# EasyEDA Pro project adapter_rfm95w_nrf242.eprj, board PCB5
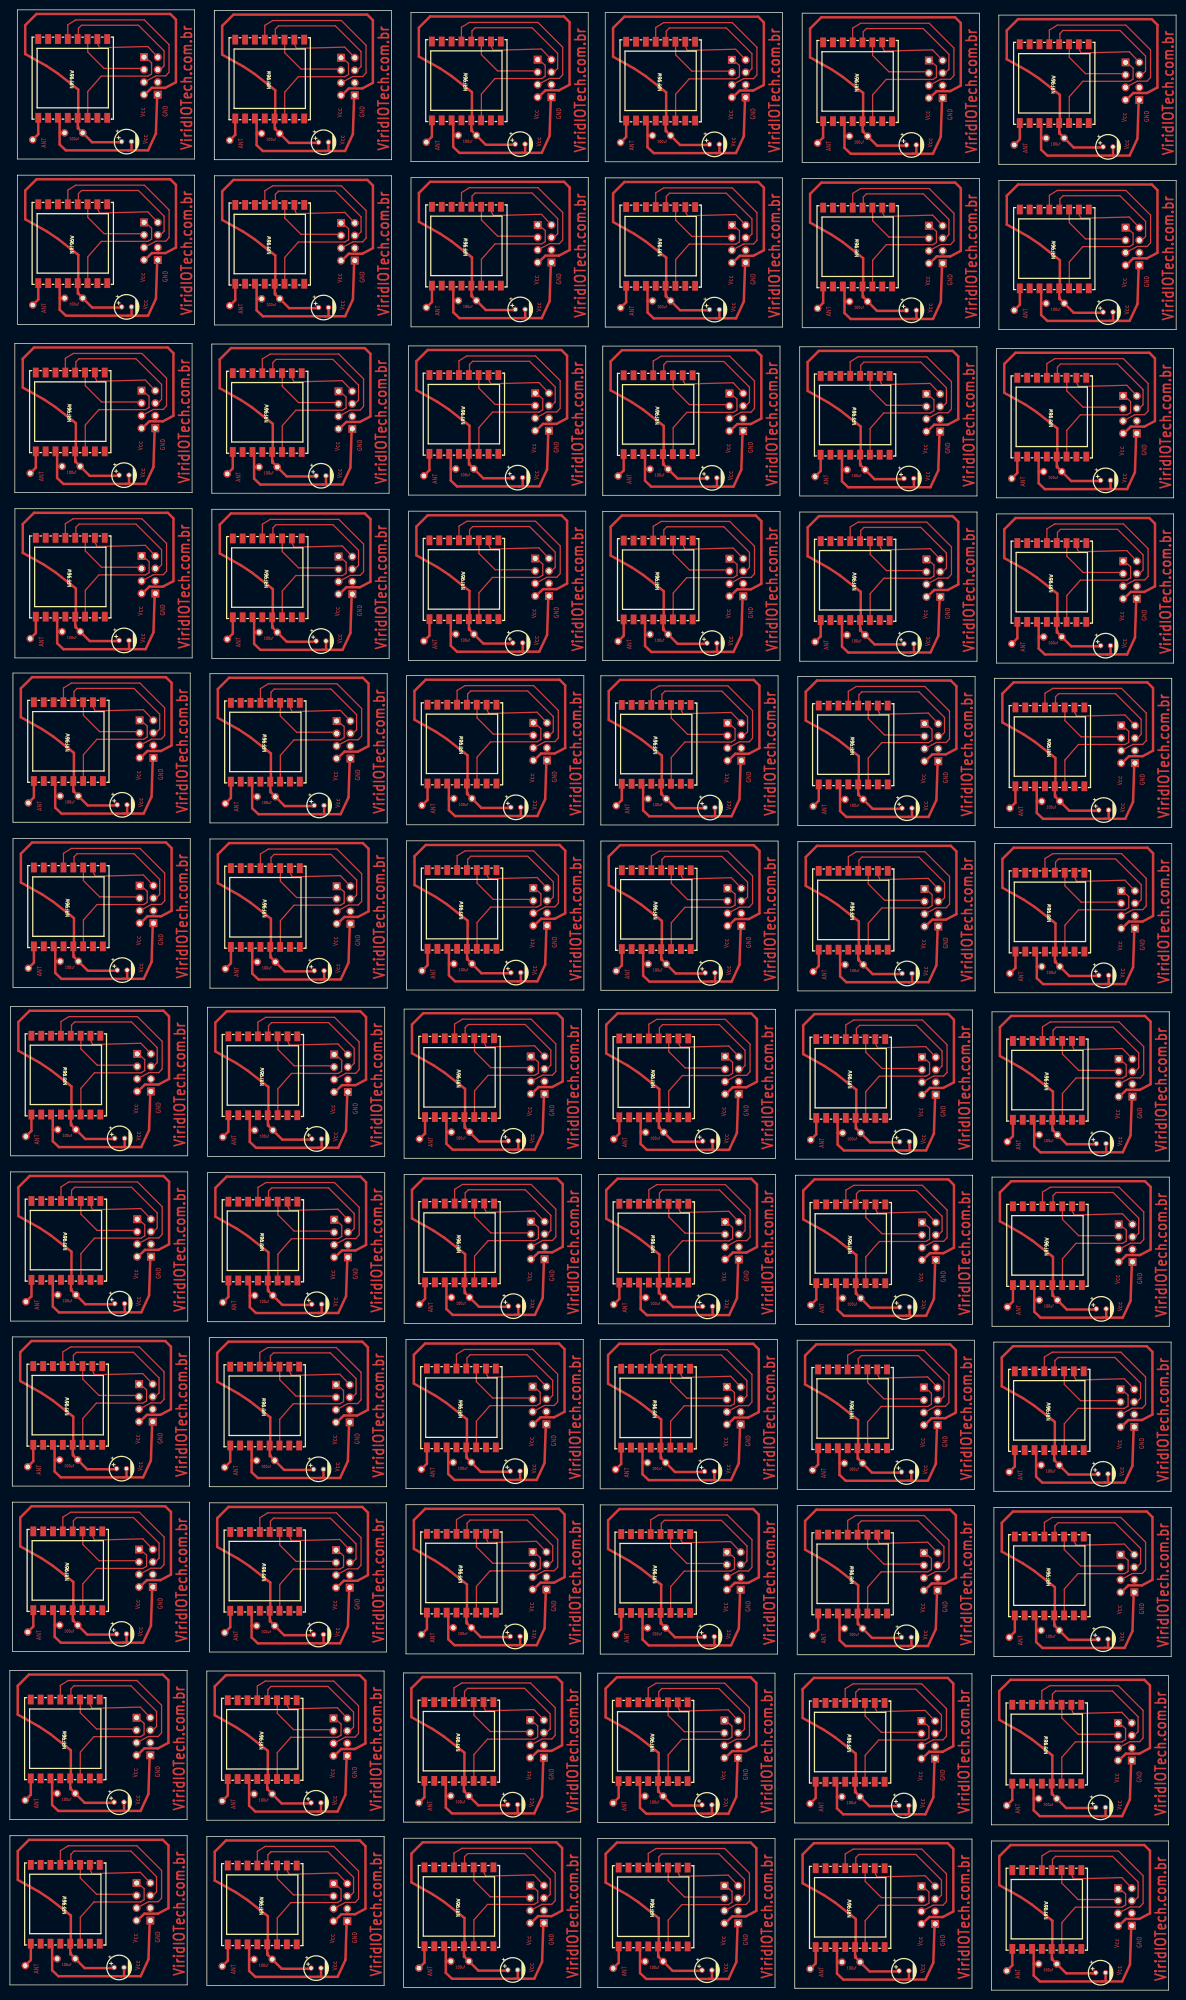
[diagram p3: board, top side]
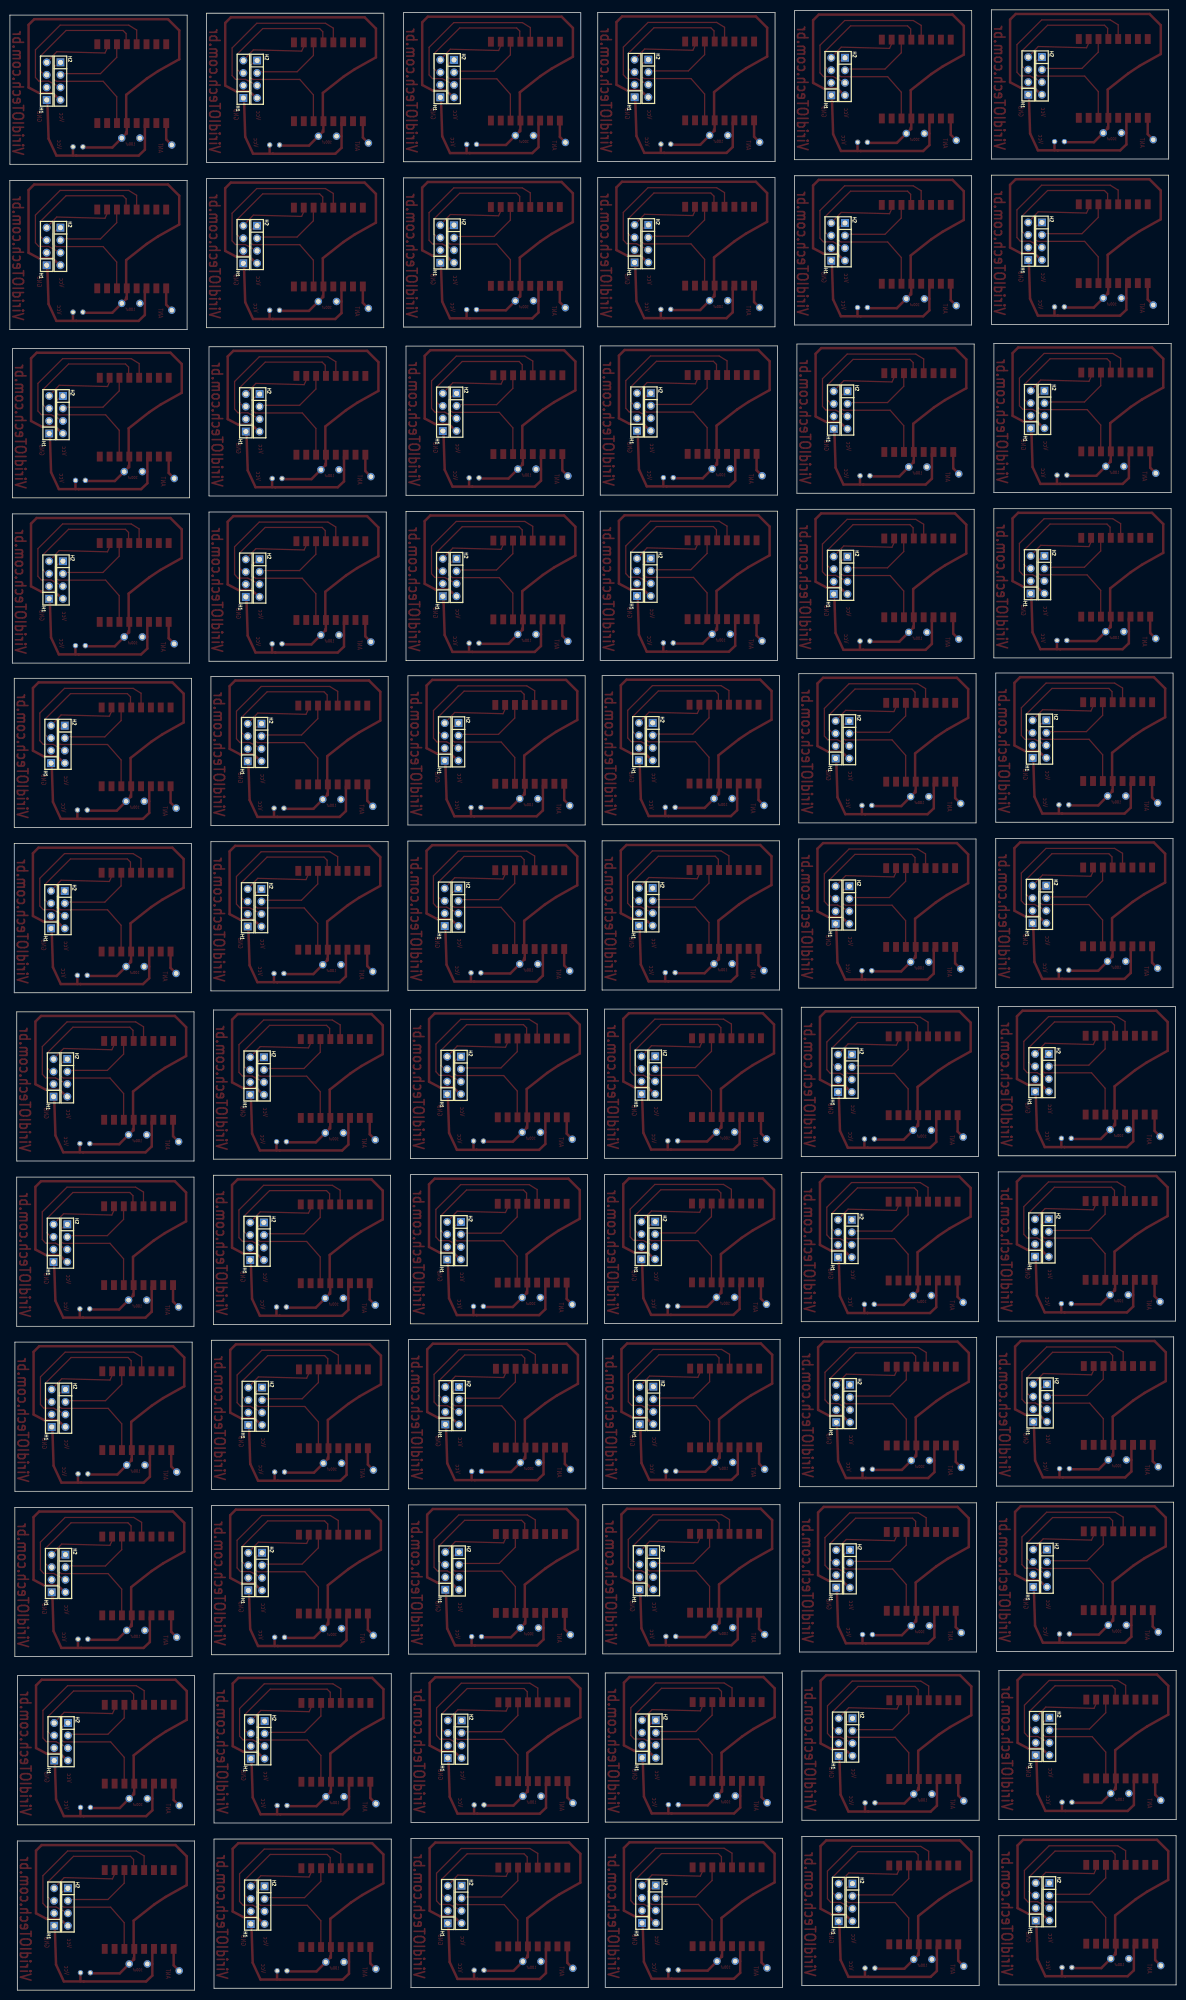
[diagram p4: board, bottom side, seen from below]

Outline 236.87 x 401.97 mm; copper layers: Top Layer, Bottom Layer. Coordinates in mm from the lower left corner of the outline.
Stack: Top Layer 0.035mm / Dielectric1 1.51mm FR4 er 4.5 / Bottom Layer 0.035mm

## Design rules (mm)
template: JLCPCB Capability(Two Layers Board)
spacing copperThickness1oz (default): track to track 0.102, other pairs 0.152 to 0.3
spacing copperThickness2oz: track to track 0.203, other pairs 0.152 to 0.3
track width copperThickness1oz (default): min 0.127, default 0.254, max 2.54
track width copperThickness2oz: min 0.203, default 0.254, max 2.54
differential pair differentialPair (default): width min 0.127, default 0.254, max 2.54; gap min 0.152, default 0.152
via viaSize (default): diameter min 0.5, default 0.61, max 10; hole min 0.3, default 0.305, max 6.3

## Placement (name value [footprint] x y rotation side)
+  -  [CAP-TH_BD5.0-P2.00-D0.5-FD]  103.64 374.71 0 top
+#2  -  [CAP-TH_BD5.0-P2.00-D0.5-FD]  143.09 374.67 0 top
+#3  -  [CAP-TH_BD5.0-P2.00-D0.5-FD]  183.09 374.54 0 top
+#4  -  [CAP-TH_BD5.0-P2.00-D0.5-FD]  223.03 374.16 0 top
+#5  -  [CAP-TH_BD5.0-P2.00-D0.5-FD]  23.69 375.22 0 top
+#6  -  [CAP-TH_BD5.0-P2.00-D0.5-FD]  23.7 341.67 0 top
+#7  -  [CAP-TH_BD5.0-P2.00-D0.5-FD]  63.71 341.54 0 top
+#8  -  [CAP-TH_BD5.0-P2.00-D0.5-FD]  103.65 341.16 0 top
+#9  -  [CAP-TH_BD5.0-P2.00-D0.5-FD]  143.1 341.12 0 top
+#10  -  [CAP-TH_BD5.0-P2.00-D0.5-FD]  183.1 340.99 0 top
+#11  -  [CAP-TH_BD5.0-P2.00-D0.5-FD]  223.04 340.61 0 top
+#12  -  [CAP-TH_BD5.0-P2.00-D0.5-FD]  22.3 172.9 0 top
+#13  -  [CAP-TH_BD5.0-P2.00-D0.5-FD]  22.31 139.35 0 top
+#14  -  [CAP-TH_BD5.0-P2.00-D0.5-FD]  22.81 240.6 0 top
+#15  -  [CAP-TH_BD5.0-P2.00-D0.5-FD]  22.81 207.05 0 top
+#16  -  [CAP-TH_BD5.0-P2.00-D0.5-FD]  62.31 172.77 0 top
+#17  -  [CAP-TH_BD5.0-P2.00-D0.5-FD]  62.31 139.22 0 top
+#18  -  [CAP-TH_BD5.0-P2.00-D0.5-FD]  62.81 240.47 0 top
+#19  -  [CAP-TH_BD5.0-P2.00-D0.5-FD]  62.82 206.92 0 top
+#20  -  [CAP-TH_BD5.0-P2.00-D0.5-FD]  102.25 172.39 0 top
+#21  -  [CAP-TH_BD5.0-P2.00-D0.5-FD]  102.25 138.84 0 top
+#22  -  [CAP-TH_BD5.0-P2.00-D0.5-FD]  102.75 240.09 0 top
+#23  -  [CAP-TH_BD5.0-P2.00-D0.5-FD]  102.76 206.54 0 top
+#24  -  [CAP-TH_BD5.0-P2.00-D0.5-FD]  141.7 172.35 0 top
+#25  -  [CAP-TH_BD5.0-P2.00-D0.5-FD]  141.7 138.8 0 top
+#26  -  [CAP-TH_BD5.0-P2.00-D0.5-FD]  142.2 240.05 0 top
+#27  -  [CAP-TH_BD5.0-P2.00-D0.5-FD]  142.21 206.5 0 top
+#28  -  [CAP-TH_BD5.0-P2.00-D0.5-FD]  181.7 172.22 0 top
+#29  -  [CAP-TH_BD5.0-P2.00-D0.5-FD]  181.71 138.67 0 top
+#30  -  [CAP-TH_BD5.0-P2.00-D0.5-FD]  182.21 239.92 0 top
+#31  -  [CAP-TH_BD5.0-P2.00-D0.5-FD]  182.21 206.37 0 top
+#32  -  [CAP-TH_BD5.0-P2.00-D0.5-FD]  221.64 171.84 0 top
+#33  -  [CAP-TH_BD5.0-P2.00-D0.5-FD]  221.65 138.29 0 top
+#34  -  [CAP-TH_BD5.0-P2.00-D0.5-FD]  222.15 239.54 0 top
+#35  -  [CAP-TH_BD5.0-P2.00-D0.5-FD]  222.15 205.99 0 top
+#36  -  [CAP-TH_BD5.0-P2.00-D0.5-FD]  22.17 38.15 0 top
+#37  -  [CAP-TH_BD5.0-P2.00-D0.5-FD]  22.18 4.6 0 top
+#38  -  [CAP-TH_BD5.0-P2.00-D0.5-FD]  22.68 105.85 0 top
+#39  -  [CAP-TH_BD5.0-P2.00-D0.5-FD]  22.69 72.3 0 top
+#40  -  [CAP-TH_BD5.0-P2.00-D0.5-FD]  62.18 38.03 0 top
+#41  -  [CAP-TH_BD5.0-P2.00-D0.5-FD]  62.19 4.48 0 top
+#42  -  [CAP-TH_BD5.0-P2.00-D0.5-FD]  62.68 105.73 0 top
+#43  -  [CAP-TH_BD5.0-P2.00-D0.5-FD]  62.69 72.18 0 top
+#44  -  [CAP-TH_BD5.0-P2.00-D0.5-FD]  102.12 37.64 0 top
+#45  -  [CAP-TH_BD5.0-P2.00-D0.5-FD]  102.13 4.09 0 top
+#46  -  [CAP-TH_BD5.0-P2.00-D0.5-FD]  102.62 105.35 0 top
+#47  -  [CAP-TH_BD5.0-P2.00-D0.5-FD]  102.63 71.8 0 top
+#48  -  [CAP-TH_BD5.0-P2.00-D0.5-FD]  141.57 37.6 0 top
+#49  -  [CAP-TH_BD5.0-P2.00-D0.5-FD]  141.58 4.05 0 top
+#50  -  [CAP-TH_BD5.0-P2.00-D0.5-FD]  142.07 105.3 0 top
+#51  -  [CAP-TH_BD5.0-P2.00-D0.5-FD]  142.08 71.75 0 top
+#52  -  [CAP-TH_BD5.0-P2.00-D0.5-FD]  181.57 37.47 0 top
+#53  -  [CAP-TH_BD5.0-P2.00-D0.5-FD]  181.58 3.92 0 top
+#54  -  [CAP-TH_BD5.0-P2.00-D0.5-FD]  182.08 105.17 0 top
+#55  -  [CAP-TH_BD5.0-P2.00-D0.5-FD]  182.09 71.62 0 top
+#56  -  [CAP-TH_BD5.0-P2.00-D0.5-FD]  221.51 37.09 0 top
+#57  -  [CAP-TH_BD5.0-P2.00-D0.5-FD]  221.52 3.54 0 top
+#58  -  [CAP-TH_BD5.0-P2.00-D0.5-FD]  222.02 104.79 0 top
+#59  -  [CAP-TH_BD5.0-P2.00-D0.5-FD]  222.03 71.24 0 top
+#60  -  [CAP-TH_BD5.0-P2.00-D0.5-FD]  63.7 375.09 0 top
+#61  -  [CAP-TH_BD5.0-P2.00-D0.5-FD]  23.19 307.52 0 top
+#62  -  [CAP-TH_BD5.0-P2.00-D0.5-FD]  63.19 307.39 0 top
+#63  -  [CAP-TH_BD5.0-P2.00-D0.5-FD]  103.13 307.01 0 top
+#64  -  [CAP-TH_BD5.0-P2.00-D0.5-FD]  142.59 306.97 0 top
+#65  -  [CAP-TH_BD5.0-P2.00-D0.5-FD]  182.59 306.84 0 top
+#66  -  [CAP-TH_BD5.0-P2.00-D0.5-FD]  222.53 306.46 0 top
+#67  -  [CAP-TH_BD5.0-P2.00-D0.5-FD]  23.2 273.97 0 top
+#68  -  [CAP-TH_BD5.0-P2.00-D0.5-FD]  63.2 273.84 0 top
+#69  -  [CAP-TH_BD5.0-P2.00-D0.5-FD]  103.14 273.46 0 top
+#70  -  [CAP-TH_BD5.0-P2.00-D0.5-FD]  142.59 273.42 0 top
+#71  -  [CAP-TH_BD5.0-P2.00-D0.5-FD]  182.6 273.29 0 top
+#72  -  [CAP-TH_BD5.0-P2.00-D0.5-FD]  222.54 272.91 0 top
H1  -  [HDR-TH_4P-HX-PH254-01-04-Z-L11.5]  69.16 253.81 90 bottom
H1#2  -  [HDR-TH_4P-HX-PH254-01-04-Z-L11.5]  69.17 220.26 90 bottom
H1#3  -  [HDR-TH_4P-HX-PH254-01-04-Z-L11.5]  109.99 388.05 90 bottom
H1#4  -  [HDR-TH_4P-HX-PH254-01-04-Z-L11.5]  149.44 388 90 bottom
H1#5  -  [HDR-TH_4P-HX-PH254-01-04-Z-L11.5]  189.44 387.88 90 bottom
H1#6  -  [HDR-TH_4P-HX-PH254-01-04-Z-L11.5]  229.38 387.5 90 bottom
H1#7  -  [HDR-TH_4P-HX-PH254-01-04-Z-L11.5]  30.04 388.56 90 bottom
H1#8  -  [HDR-TH_4P-HX-PH254-01-04-Z-L11.5]  30.05 355.01 90 bottom
H1#9  -  [HDR-TH_4P-HX-PH254-01-04-Z-L11.5]  70.06 354.88 90 bottom
H1#10  -  [HDR-TH_4P-HX-PH254-01-04-Z-L11.5]  110 354.5 90 bottom
H1#11  -  [HDR-TH_4P-HX-PH254-01-04-Z-L11.5]  149.45 354.45 90 bottom
H1#12  -  [HDR-TH_4P-HX-PH254-01-04-Z-L11.5]  189.45 354.33 90 bottom
H1#13  -  [HDR-TH_4P-HX-PH254-01-04-Z-L11.5]  28.65 186.23 90 bottom
H1#14  -  [HDR-TH_4P-HX-PH254-01-04-Z-L11.5]  28.66 152.68 90 bottom
H1#15  -  [HDR-TH_4P-HX-PH254-01-04-Z-L11.5]  29.16 253.94 90 bottom
H1#16  -  [HDR-TH_4P-HX-PH254-01-04-Z-L11.5]  29.16 220.39 90 bottom
H1#17  -  [HDR-TH_4P-HX-PH254-01-04-Z-L11.5]  68.66 186.11 90 bottom
H1#18  -  [HDR-TH_4P-HX-PH254-01-04-Z-L11.5]  68.66 152.56 90 bottom
H1#19  -  [HDR-TH_4P-HX-PH254-01-04-Z-L11.5]  108.6 185.73 90 bottom
H1#20  -  [HDR-TH_4P-HX-PH254-01-04-Z-L11.5]  108.6 152.18 90 bottom
H1#21  -  [HDR-TH_4P-HX-PH254-01-04-Z-L11.5]  109.1 253.43 90 bottom
H1#22  -  [HDR-TH_4P-HX-PH254-01-04-Z-L11.5]  109.11 219.88 90 bottom
H1#23  -  [HDR-TH_4P-HX-PH254-01-04-Z-L11.5]  229.39 353.95 90 bottom
H1#24  -  [HDR-TH_4P-HX-PH254-01-04-Z-L11.5]  148.05 185.68 90 bottom
H1#25  -  [HDR-TH_4P-HX-PH254-01-04-Z-L11.5]  148.05 152.13 90 bottom
H1#26  -  [HDR-TH_4P-HX-PH254-01-04-Z-L11.5]  148.55 253.38 90 bottom
H1#27  -  [HDR-TH_4P-HX-PH254-01-04-Z-L11.5]  148.56 219.83 90 bottom
H1#28  -  [HDR-TH_4P-HX-PH254-01-04-Z-L11.5]  188.05 185.55 90 bottom
H1#29  -  [HDR-TH_4P-HX-PH254-01-04-Z-L11.5]  188.06 152 90 bottom
H1#30  -  [HDR-TH_4P-HX-PH254-01-04-Z-L11.5]  188.56 253.26 90 bottom
H1#31  -  [HDR-TH_4P-HX-PH254-01-04-Z-L11.5]  188.56 219.71 90 bottom
H1#32  -  [HDR-TH_4P-HX-PH254-01-04-Z-L11.5]  227.99 185.17 90 bottom
H1#33  -  [HDR-TH_4P-HX-PH254-01-04-Z-L11.5]  228 151.62 90 bottom
H1#34  -  [HDR-TH_4P-HX-PH254-01-04-Z-L11.5]  228.5 252.88 90 bottom
H1#35  -  [HDR-TH_4P-HX-PH254-01-04-Z-L11.5]  228.5 219.33 90 bottom
H1#36  -  [HDR-TH_4P-HX-PH254-01-04-Z-L11.5]  28.52 51.49 90 bottom
H1#37  -  [HDR-TH_4P-HX-PH254-01-04-Z-L11.5]  28.53 17.94 90 bottom
H1#38  -  [HDR-TH_4P-HX-PH254-01-04-Z-L11.5]  29.03 119.19 90 bottom
H1#39  -  [HDR-TH_4P-HX-PH254-01-04-Z-L11.5]  29.04 85.64 90 bottom
H1#40  -  [HDR-TH_4P-HX-PH254-01-04-Z-L11.5]  68.53 51.36 90 bottom
H1#41  -  [HDR-TH_4P-HX-PH254-01-04-Z-L11.5]  68.54 17.81 90 bottom
H1#42  -  [HDR-TH_4P-HX-PH254-01-04-Z-L11.5]  69.03 119.06 90 bottom
H1#43  -  [HDR-TH_4P-HX-PH254-01-04-Z-L11.5]  69.04 85.51 90 bottom
H1#44  -  [HDR-TH_4P-HX-PH254-01-04-Z-L11.5]  108.47 50.98 90 bottom
H1#45  -  [HDR-TH_4P-HX-PH254-01-04-Z-L11.5]  108.48 17.43 90 bottom
H1#46  -  [HDR-TH_4P-HX-PH254-01-04-Z-L11.5]  108.97 118.68 90 bottom
H1#47  -  [HDR-TH_4P-HX-PH254-01-04-Z-L11.5]  108.98 85.13 90 bottom
H1#48  -  [HDR-TH_4P-HX-PH254-01-04-Z-L11.5]  147.92 50.93 90 bottom
H1#49  -  [HDR-TH_4P-HX-PH254-01-04-Z-L11.5]  147.93 17.38 90 bottom
H1#50  -  [HDR-TH_4P-HX-PH254-01-04-Z-L11.5]  148.42 118.64 90 bottom
H1#51  -  [HDR-TH_4P-HX-PH254-01-04-Z-L11.5]  148.43 85.09 90 bottom
H1#52  -  [HDR-TH_4P-HX-PH254-01-04-Z-L11.5]  187.92 50.81 90 bottom
H1#53  -  [HDR-TH_4P-HX-PH254-01-04-Z-L11.5]  187.93 17.26 90 bottom
H1#54  -  [HDR-TH_4P-HX-PH254-01-04-Z-L11.5]  188.43 118.51 90 bottom
H1#55  -  [HDR-TH_4P-HX-PH254-01-04-Z-L11.5]  188.44 84.96 90 bottom
H1#56  -  [HDR-TH_4P-HX-PH254-01-04-Z-L11.5]  227.86 50.43 90 bottom
H1#57  -  [HDR-TH_4P-HX-PH254-01-04-Z-L11.5]  227.87 16.88 90 bottom
H1#58  -  [HDR-TH_4P-HX-PH254-01-04-Z-L11.5]  228.37 118.13 90 bottom
H1#59  -  [HDR-TH_4P-HX-PH254-01-04-Z-L11.5]  228.38 84.58 90 bottom
H1#60  -  [HDR-TH_4P-HX-PH254-01-04-Z-L11.5]  70.05 388.43 90 bottom
H1#61  -  [HDR-TH_4P-HX-PH254-01-04-Z-L11.5]  29.54 320.85 90 bottom
H1#62  -  [HDR-TH_4P-HX-PH254-01-04-Z-L11.5]  69.55 320.73 90 bottom
H1#63  -  [HDR-TH_4P-HX-PH254-01-04-Z-L11.5]  109.48 320.35 90 bottom
H1#64  -  [HDR-TH_4P-HX-PH254-01-04-Z-L11.5]  148.94 320.3 90 bottom
H1#65  -  [HDR-TH_4P-HX-PH254-01-04-Z-L11.5]  188.94 320.17 90 bottom
H1#66  -  [HDR-TH_4P-HX-PH254-01-04-Z-L11.5]  228.88 319.79 90 bottom
H1#67  -  [HDR-TH_4P-HX-PH254-01-04-Z-L11.5]  29.55 287.3 90 bottom
H1#68  -  [HDR-TH_4P-HX-PH254-01-04-Z-L11.5]  69.55 287.18 90 bottom
H1#69  -  [HDR-TH_4P-HX-PH254-01-04-Z-L11.5]  109.49 286.8 90 bottom
H1#70  -  [HDR-TH_4P-HX-PH254-01-04-Z-L11.5]  148.94 286.75 90 bottom
H1#71  -  [HDR-TH_4P-HX-PH254-01-04-Z-L11.5]  188.95 286.62 90 bottom
H1#72  -  [HDR-TH_4P-HX-PH254-01-04-Z-L11.5]  228.89 286.24 90 bottom
H2  -  [HDR-TH_4P-HX-PH254-01-04-Z-L11.5]  107.19 388.05 270 bottom
H2#2  -  [HDR-TH_4P-HX-PH254-01-04-Z-L11.5]  146.65 388 270 bottom
H2#3  -  [HDR-TH_4P-HX-PH254-01-04-Z-L11.5]  186.65 387.88 270 bottom
H2#4  -  [HDR-TH_4P-HX-PH254-01-04-Z-L11.5]  226.59 387.5 270 bottom
H2#5  -  [HDR-TH_4P-HX-PH254-01-04-Z-L11.5]  27.25 388.56 270 bottom
H2#6  -  [HDR-TH_4P-HX-PH254-01-04-Z-L11.5]  27.26 355.01 270 bottom
H2#7  -  [HDR-TH_4P-HX-PH254-01-04-Z-L11.5]  67.26 354.88 270 bottom
H2#8  -  [HDR-TH_4P-HX-PH254-01-04-Z-L11.5]  107.2 354.5 270 bottom
H2#9  -  [HDR-TH_4P-HX-PH254-01-04-Z-L11.5]  146.65 354.45 270 bottom
H2#10  -  [HDR-TH_4P-HX-PH254-01-04-Z-L11.5]  186.66 354.33 270 bottom
H2#11  -  [HDR-TH_4P-HX-PH254-01-04-Z-L11.5]  25.86 186.23 270 bottom
H2#12  -  [HDR-TH_4P-HX-PH254-01-04-Z-L11.5]  25.86 152.68 270 bottom
H2#13  -  [HDR-TH_4P-HX-PH254-01-04-Z-L11.5]  26.36 253.94 270 bottom
H2#14  -  [HDR-TH_4P-HX-PH254-01-04-Z-L11.5]  26.37 220.39 270 bottom
H2#15  -  [HDR-TH_4P-HX-PH254-01-04-Z-L11.5]  65.86 186.11 270 bottom
H2#16  -  [HDR-TH_4P-HX-PH254-01-04-Z-L11.5]  65.87 152.56 270 bottom
H2#17  -  [HDR-TH_4P-HX-PH254-01-04-Z-L11.5]  66.37 253.81 270 bottom
H2#18  -  [HDR-TH_4P-HX-PH254-01-04-Z-L11.5]  66.37 220.26 270 bottom
H2#19  -  [HDR-TH_4P-HX-PH254-01-04-Z-L11.5]  226.6 353.95 270 bottom
H2#20  -  [HDR-TH_4P-HX-PH254-01-04-Z-L11.5]  105.8 185.73 270 bottom
H2#21  -  [HDR-TH_4P-HX-PH254-01-04-Z-L11.5]  105.81 152.18 270 bottom
H2#22  -  [HDR-TH_4P-HX-PH254-01-04-Z-L11.5]  106.31 253.43 270 bottom
H2#23  -  [HDR-TH_4P-HX-PH254-01-04-Z-L11.5]  106.31 219.88 270 bottom
H2#24  -  [HDR-TH_4P-HX-PH254-01-04-Z-L11.5]  145.25 185.68 270 bottom
H2#25  -  [HDR-TH_4P-HX-PH254-01-04-Z-L11.5]  145.26 152.13 270 bottom
H2#26  -  [HDR-TH_4P-HX-PH254-01-04-Z-L11.5]  145.76 253.38 270 bottom
H2#27  -  [HDR-TH_4P-HX-PH254-01-04-Z-L11.5]  145.76 219.83 270 bottom
H2#28  -  [HDR-TH_4P-HX-PH254-01-04-Z-L11.5]  185.26 185.55 270 bottom
H2#29  -  [HDR-TH_4P-HX-PH254-01-04-Z-L11.5]  185.26 152 270 bottom
H2#30  -  [HDR-TH_4P-HX-PH254-01-04-Z-L11.5]  185.76 253.26 270 bottom
H2#31  -  [HDR-TH_4P-HX-PH254-01-04-Z-L11.5]  185.77 219.71 270 bottom
H2#32  -  [HDR-TH_4P-HX-PH254-01-04-Z-L11.5]  225.2 185.17 270 bottom
H2#33  -  [HDR-TH_4P-HX-PH254-01-04-Z-L11.5]  225.2 151.62 270 bottom
H2#34  -  [HDR-TH_4P-HX-PH254-01-04-Z-L11.5]  225.7 252.88 270 bottom
H2#35  -  [HDR-TH_4P-HX-PH254-01-04-Z-L11.5]  225.71 219.33 270 bottom
H2#36  -  [HDR-TH_4P-HX-PH254-01-04-Z-L11.5]  25.73 51.49 270 bottom
H2#37  -  [HDR-TH_4P-HX-PH254-01-04-Z-L11.5]  25.74 17.94 270 bottom
H2#38  -  [HDR-TH_4P-HX-PH254-01-04-Z-L11.5]  26.23 119.19 270 bottom
H2#39  -  [HDR-TH_4P-HX-PH254-01-04-Z-L11.5]  26.24 85.64 270 bottom
H2#40  -  [HDR-TH_4P-HX-PH254-01-04-Z-L11.5]  65.73 51.36 270 bottom
H2#41  -  [HDR-TH_4P-HX-PH254-01-04-Z-L11.5]  65.74 17.81 270 bottom
H2#42  -  [HDR-TH_4P-HX-PH254-01-04-Z-L11.5]  66.24 119.06 270 bottom
H2#43  -  [HDR-TH_4P-HX-PH254-01-04-Z-L11.5]  66.25 85.51 270 bottom
H2#44  -  [HDR-TH_4P-HX-PH254-01-04-Z-L11.5]  105.67 50.98 270 bottom
H2#45  -  [HDR-TH_4P-HX-PH254-01-04-Z-L11.5]  105.68 17.43 270 bottom
H2#46  -  [HDR-TH_4P-HX-PH254-01-04-Z-L11.5]  106.18 118.68 270 bottom
H2#47  -  [HDR-TH_4P-HX-PH254-01-04-Z-L11.5]  106.19 85.13 270 bottom
H2#48  -  [HDR-TH_4P-HX-PH254-01-04-Z-L11.5]  145.12 50.93 270 bottom
H2#49  -  [HDR-TH_4P-HX-PH254-01-04-Z-L11.5]  145.13 17.38 270 bottom
H2#50  -  [HDR-TH_4P-HX-PH254-01-04-Z-L11.5]  145.63 118.64 270 bottom
H2#51  -  [HDR-TH_4P-HX-PH254-01-04-Z-L11.5]  145.64 85.09 270 bottom
H2#52  -  [HDR-TH_4P-HX-PH254-01-04-Z-L11.5]  185.13 50.81 270 bottom
H2#53  -  [HDR-TH_4P-HX-PH254-01-04-Z-L11.5]  185.14 17.26 270 bottom
H2#54  -  [HDR-TH_4P-HX-PH254-01-04-Z-L11.5]  185.63 118.51 270 bottom
H2#55  -  [HDR-TH_4P-HX-PH254-01-04-Z-L11.5]  185.64 84.96 270 bottom
H2#56  -  [HDR-TH_4P-HX-PH254-01-04-Z-L11.5]  225.07 50.43 270 bottom
H2#57  -  [HDR-TH_4P-HX-PH254-01-04-Z-L11.5]  225.08 16.88 270 bottom
H2#58  -  [HDR-TH_4P-HX-PH254-01-04-Z-L11.5]  225.57 118.13 270 bottom
H2#59  -  [HDR-TH_4P-HX-PH254-01-04-Z-L11.5]  225.58 84.58 270 bottom
H2#60  -  [HDR-TH_4P-HX-PH254-01-04-Z-L11.5]  67.25 388.43 270 bottom
H2#61  -  [HDR-TH_4P-HX-PH254-01-04-Z-L11.5]  26.75 320.85 270 bottom
H2#62  -  [HDR-TH_4P-HX-PH254-01-04-Z-L11.5]  66.75 320.73 270 bottom
H2#63  -  [HDR-TH_4P-HX-PH254-01-04-Z-L11.5]  106.69 320.35 270 bottom
H2#64  -  [HDR-TH_4P-HX-PH254-01-04-Z-L11.5]  146.14 320.3 270 bottom
H2#65  -  [HDR-TH_4P-HX-PH254-01-04-Z-L11.5]  186.15 320.17 270 bottom
H2#66  -  [HDR-TH_4P-HX-PH254-01-04-Z-L11.5]  226.09 319.79 270 bottom
H2#67  -  [HDR-TH_4P-HX-PH254-01-04-Z-L11.5]  26.75 287.3 270 bottom
H2#68  -  [HDR-TH_4P-HX-PH254-01-04-Z-L11.5]  66.76 287.18 270 bottom
H2#69  -  [HDR-TH_4P-HX-PH254-01-04-Z-L11.5]  106.7 286.8 270 bottom
H2#70  -  [HDR-TH_4P-HX-PH254-01-04-Z-L11.5]  146.15 286.75 270 bottom
H2#71  -  [HDR-TH_4P-HX-PH254-01-04-Z-L11.5]  186.15 286.62 270 bottom
H2#72  -  [HDR-TH_4P-HX-PH254-01-04-Z-L11.5]  226.09 286.24 270 bottom
NOREF  -  [Pad_e799]  4.15 274.35 0 top
NOREF#2  -  [Pad_e4188]  53.92 242.25 0 top
NOREF#3  -  [Pad_e4182]  49.73 174.55 0 top
NOREF#4  -  [Pad_e4183]  49.74 141 0 top
NOREF#5  -  [Pad_e5089]  173.2 73.4 0 top
NOREF#6  -  [Pad_e4230]  209.07 173.62 0 top
NOREF#7  -  [Pad_e407]  203.99 340.99 0 top
NOREF#8  -  [Pad_e393]  130.52 342.9 0 top
NOREF#9  -  [Pad_e5066]  122.52 37.98 0 top
NOREF#10  -  [Pad_e31]  4.64 375.6 0 top
NOREF#11  -  [Pad_e5099]  212.63 5.32 0 top
NOREF#12  -  [Pad_e199]  170.52 376.32 0 top
NOREF#13  -  [Pad_e392]  14.81 343.45 0 top
NOREF#14  -  [Pad_e784]  54.31 275.62 0 top
NOREF#15  -  [Pad_e812]  203.48 306.84 0 top
NOREF#16  -  [Pad_e4168]  3.75 240.98 0 top
NOREF#17  -  [Pad_e807]  209.96 274.69 0 top
NOREF#18  -  [Pad_e4235]  212.76 140.07 0 top
NOREF#19  -  [Pad_e4189]  53.93 208.7 0 top
NOREF#20  -  [Pad_e4223]  172.82 140.45 0 top
NOREF#21  -  [Pad_e802]  123.54 273.8 0 top
NOREF#22  -  [Pad_e404]  164.05 341.37 0 top
NOREF#23  -  [Pad_e5097]  209.45 73.02 0 top
NOREF#24  -  [Pad_e4206]  129.12 174.12 0 top
NOREF#25  -  [Pad_e4236]  213.26 241.32 0 top
NOREF#26  -  [Pad_e4209]  129.63 208.28 0 top
NOREF#27  -  [Pad_e5039]  13.29 6.38 0 top
NOREF#28  -  [Pad_e5101]  213.14 73.02 0 top
NOREF#29  -  [Pad_e5043]  43.14 4.86 0 top
NOREF#30  -  [Pad_e4227]  202.6 138.67 0 top
NOREF#31  -  [Pad_e781]  133.7 275.19 0 top
NOREF#32  -  [Pad_e5030]  3.12 38.53 0 top
NOREF#33  -  [Pad_e4232]  209.57 241.32 0 top
NOREF#34  -  [Pad_e4169]  3.76 207.43 0 top
NOREF#35  -  [Pad_e4225]  173.32 208.15 0 top
NOREF#36  -  [Pad_e5083]  169.01 5.7 0 top
NOREF#37  -  [Pad_e391]  11.13 343.45 0 top
NOREF#38  -  [Pad_e198]  174.2 376.32 0 top
NOREF#39  -  [Pad_e794]  133.7 308.74 0 top
NOREF#40  -  [Pad_e103]  84.59 375.09 0 top
NOREF#41  -  [Pad_e4211]  132.81 140.57 0 top
NOREF#42  -  [Pad_e5086]  172.68 39.25 0 top
NOREF#43  -  [Pad_e4231]  209.08 140.07 0 top
NOREF#44  -  [Pad_e5057]  83.58 72.18 0 top
NOREF#45  -  [Pad_e787]  50.62 309.17 0 top
NOREF#46  -  [Pad_e5052]  53.79 107.51 0 top
NOREF#47  -  [Pad_e5080]  163.03 105.56 0 top
NOREF#48  -  [Pad_e4181]  43.77 207.31 0 top
NOREF#49  -  [Pad_e4185]  50.24 208.7 0 top
NOREF#50  -  [Pad_e4196]  90.18 241.87 0 top
NOREF#51  -  [Pad_e5077]  133.19 73.53 0 top
NOREF#52  -  [Pad_e793]  130.01 308.74 0 top
NOREF#53  -  [Pad_e4214]  162.65 172.6 0 top
NOREF#54  -  [Pad_e783]  50.63 275.62 0 top
NOREF#55  -  [Pad_e200]  164.04 374.92 0 top
NOREF#56  -  [Pad_e796]  10.62 309.3 0 top
NOREF#57  -  [Pad_e5047]  49.61 6.25 0 top
NOREF#58  -  [Pad_e402]  174.21 342.77 0 top
NOREF#59  -  [Pad_e5045]  43.64 72.56 0 top
NOREF#60  -  [Pad_e5044]  43.63 106.11 0 top
NOREF#61  -  [Pad_e5078]  162.52 37.85 0 top
NOREF#62  -  [Pad_e4191]  83.2 139.22 0 top
NOREF#63  -  [Pad_e4202]  122.65 172.73 0 top
NOREF#64  -  [Pad_e5070]  129 39.38 0 top
NOREF#65  -  [Pad_e5075]  132.69 5.83 0 top
NOREF#66  -  [Pad_e5063]  93.24 5.87 0 top
NOREF#67  -  [Pad_e806]  213.65 274.69 0 top
NOREF#68  -  [Pad_e4200]  93.86 241.87 0 top
NOREF#69  -  [Pad_e29]  14.8 377 0 top
NOREF#70  -  [Pad_e4187]  53.42 141 0 top
NOREF#71  -  [Pad_e5095]  208.95 5.32 0 top
NOREF#72  -  [Pad_e4193]  83.71 206.92 0 top
NOREF#73  -  [Pad_e4220]  169.63 241.7 0 top
NOREF#74  -  [Pad_e5073]  129.51 73.53 0 top
NOREF#75  -  [Pad_e789]  84.08 307.39 0 top
NOREF#76  -  [Pad_e400]  94.76 342.94 0 top
NOREF#77  -  [Pad_e5085]  169.51 73.4 0 top
NOREF#78  -  [Pad_e399]  91.07 342.94 0 top
NOREF#79  -  [Pad_e4208]  129.63 241.83 0 top
NOREF#80  -  [Pad_e4171]  9.74 141.13 0 top
NOREF#81  -  [Pad_e813]  209.96 308.24 0 top
NOREF#82  -  [Pad_e5069]  123.03 72.13 0 top
NOREF#83  -  [Pad_e814]  213.64 308.24 0 top
NOREF#84  -  [Pad_e5050]  53.29 39.8 0 top
NOREF#85  -  [Pad_e5040]  13.79 107.63 0 top
NOREF#86  -  [Pad_e5071]  129 5.83 0 top
NOREF#87  -  [Pad_e4170]  9.73 174.68 0 top
NOREF#88  -  [Pad_e782]  44.15 274.22 0 top
NOREF#89  -  [Pad_e201]  214.14 375.94 0 top
NOREF#90  -  [Pad_e197]  134.2 376.45 0 top
NOREF#91  -  [Pad_e5059]  89.55 5.87 0 top
NOREF#92  -  [Pad_e196]  130.52 376.45 0 top
NOREF#93  -  [Pad_e786]  94.25 275.24 0 top
NOREF#94  -  [Pad_e5064]  93.73 107.12 0 top
NOREF#95  -  [Pad_e4233]  209.58 207.77 0 top
NOREF#96  -  [Pad_e195]  124.04 375.05 0 top
NOREF#97  -  [Pad_e4179]  43.26 139.6 0 top
NOREF#98  -  [Pad_e4219]  169.14 140.45 0 top
NOREF#99  -  [Pad_e30]  11.12 377 0 top
NOREF#100  -  [Pad_e4210]  132.81 174.12 0 top
NOREF#101  -  [Pad_e4184]  50.24 242.25 0 top
NOREF#102  -  [Pad_e4198]  93.36 174.17 0 top
NOREF#103  -  [Pad_e4194]  89.67 174.17 0 top
NOREF#104  -  [Pad_e4166]  3.25 173.28 0 top
NOREF#105  -  [Pad_e4176]  13.92 242.38 0 top
NOREF#106  -  [Pad_e4172]  10.23 242.38 0 top
NOREF#107  -  [Pad_e5058]  89.55 39.42 0 top
NOREF#108  -  [Pad_e401]  124.05 341.5 0 top
NOREF#109  -  [Pad_e808]  203.49 273.29 0 top
NOREF#110  -  [Pad_e65]  54.81 376.87 0 top
NOREF#111  -  [Pad_e5074]  132.68 39.38 0 top
NOREF#112  -  [Pad_e5076]  133.18 107.08 0 top
NOREF#113  -  [Pad_e4229]  203.1 206.37 0 top
NOREF#114  -  [Pad_e5051]  53.3 6.25 0 top
NOREF#115  -  [Pad_e398]  84.6 341.54 0 top
NOREF#116  -  [Pad_e5048]  50.11 107.51 0 top
NOREF#117  -  [Pad_e4224]  173.32 241.7 0 top
NOREF#118  -  [Pad_e5082]  169 39.25 0 top
NOREF#119  -  [Pad_e792]  123.54 307.35 0 top
NOREF#120  -  [Pad_e5100]  213.13 106.57 0 top
NOREF#121  -  [Pad_e5061]  90.06 73.57 0 top
NOREF#122  -  [Pad_e5072]  129.5 107.08 0 top
NOREF#123  -  [Pad_e809]  163.54 307.22 0 top
NOREF#124  -  [Pad_e4175]  13.42 141.13 0 top
NOREF#125  -  [Pad_e5067]  122.53 4.43 0 top
NOREF#126  -  [Pad_e803]  173.71 275.07 0 top
NOREF#127  -  [Pad_e5096]  209.45 106.57 0 top
NOREF#128  -  [Pad_e5033]  3.64 72.69 0 top
NOREF#129  -  [Pad_e4204]  123.15 240.43 0 top
NOREF#130  -  [Pad_e5034]  9.6 39.93 0 top
NOREF#131  -  [Pad_e4226]  202.59 172.22 0 top
NOREF#132  -  [Pad_e5090]  202.46 37.47 0 top
NOREF#133  -  [Pad_e203]  203.98 374.54 0 top
NOREF#134  -  [Pad_e5032]  3.63 106.24 0 top
NOREF#135  -  [Pad_e396]  51.13 343.32 0 top
NOREF#136  -  [Pad_e5031]  3.13 4.98 0 top
NOREF#137  -  [Pad_e5079]  162.53 4.3 0 top
NOREF#138  -  [Pad_e67]  44.65 375.48 0 top
NOREF#139  -  [Pad_e5035]  9.61 6.38 0 top
NOREF#140  -  [Pad_e4215]  162.66 139.05 0 top
NOREF#141  -  [Pad_e390]  4.65 342.05 0 top
NOREF#142  -  [Pad_e5054]  83.07 38.03 0 top
NOREF#143  -  [Pad_e5062]  93.23 39.42 0 top
NOREF#144  -  [Pad_e5056]  83.57 105.73 0 top
NOREF#145  -  [Pad_e405]  214.15 342.39 0 top
NOREF#146  -  [Pad_e5036]  10.11 107.63 0 top
NOREF#147  -  [Pad_e5038]  13.28 39.93 0 top
NOREF#148  -  [Pad_e5084]  169.51 106.95 0 top
NOREF#149  -  [Pad_e4174]  13.41 174.68 0 top
NOREF#150  -  [Pad_e4205]  123.16 206.88 0 top
NOREF#151  -  [Pad_e4199]  93.36 140.62 0 top
NOREF#152  -  [Pad_e5087]  172.69 5.7 0 top
NOREF#153  -  [Pad_e5092]  202.97 105.17 0 top
NOREF#154  -  [Pad_e4207]  129.13 140.57 0 top
NOREF#155  -  [Pad_e4177]  13.92 208.83 0 top
NOREF#156  -  [Pad_e5081]  163.04 72.01 0 top
NOREF#157  -  [Pad_e5068]  123.02 105.68 0 top
NOREF#158  -  [Pad_e403]  170.53 342.77 0 top
NOREF#159  -  [Pad_e790]  90.56 308.79 0 top
NOREF#160  -  [Pad_e4167]  3.26 139.73 0 top
NOREF#161  -  [Pad_e4180]  43.76 240.86 0 top
NOREF#162  -  [Pad_e5094]  208.94 38.87 0 top
NOREF#163  -  [Pad_e804]  170.02 275.07 0 top
NOREF#164  -  [Pad_e801]  14.31 275.75 0 top
NOREF#165  -  [Pad_e798]  44.14 307.77 0 top
NOREF#166  -  [Pad_e800]  10.62 275.75 0 top
NOREF#167  -  [Pad_e4216]  163.16 240.3 0 top
NOREF#168  -  [Pad_e4212]  133.31 241.83 0 top
NOREF#169  -  [Pad_e5037]  10.11 74.08 0 top
NOREF#170  -  [Pad_e4234]  212.75 173.62 0 top
NOREF#171  -  [Pad_e4186]  53.42 174.55 0 top
NOREF#172  -  [Pad_e5041]  13.8 74.08 0 top
NOREF#173  -  [Pad_e397]  54.82 343.32 0 top
NOREF#174  -  [Pad_e5091]  202.47 3.92 0 top
NOREF#175  -  [Pad_e811]  173.7 308.62 0 top
NOREF#176  -  [Pad_e4218]  169.13 174 0 top
NOREF#177  -  [Pad_e5042]  43.13 38.41 0 top
NOREF#178  -  [Pad_e4195]  89.68 140.62 0 top
NOREF#179  -  [Pad_e795]  4.14 307.9 0 top
NOREF#180  -  [Pad_e788]  54.3 309.17 0 top
NOREF#181  -  [Pad_e791]  94.24 308.79 0 top
NOREF#182  -  [Pad_e5065]  93.74 73.57 0 top
NOREF#183  -  [Pad_e5060]  90.05 107.12 0 top
NOREF#184  -  [Pad_e4203]  122.65 139.18 0 top
NOREF#185  -  [Pad_e4173]  10.24 208.83 0 top
NOREF#186  -  [Pad_e202]  210.46 375.94 0 top
NOREF#187  -  [Pad_e810]  170.02 308.62 0 top
NOREF#188  -  [Pad_e805]  163.55 273.67 0 top
NOREF#189  -  [Pad_e4221]  169.64 208.15 0 top
NOREF#190  -  [Pad_e5098]  212.62 38.87 0 top
NOREF#191  -  [Pad_e4192]  83.7 240.47 0 top
NOREF#192  -  [Pad_e4222]  172.81 174 0 top
NOREF#193  -  [Pad_e102]  91.07 376.49 0 top
NOREF#194  -  [Pad_e4178]  43.26 173.15 0 top
NOREF#195  -  [Pad_e5055]  83.08 4.48 0 top
NOREF#196  -  [Pad_e394]  134.21 342.9 0 top
NOREF#197  -  [Pad_e4197]  90.18 208.32 0 top
NOREF#198  -  [Pad_e395]  44.66 341.93 0 top
NOREF#199  -  [Pad_e4190]  83.2 172.77 0 top
NOREF#200  -  [Pad_e4228]  203.09 239.92 0 top
NOREF#201  -  [Pad_e5053]  53.8 73.96 0 top
NOREF#202  -  [Pad_e5088]  173.19 106.95 0 top
NOREF#203  -  [Pad_e4201]  93.87 208.32 0 top
NOREF#204  -  [Pad_e780]  130.02 275.19 0 top
NOREF#205  -  [Pad_e4237]  213.26 207.77 0 top
NOREF#206  -  [Pad_e5049]  50.12 73.96 0 top
NOREF#207  -  [Pad_e406]  210.47 342.39 0 top
NOREF#208  -  [Pad_e66]  51.13 376.87 0 top
NOREF#209  -  [Pad_e4217]  163.16 206.75 0 top
NOREF#210  -  [Pad_e5046]  49.61 39.8 0 top
NOREF#211  -  [Pad_e785]  90.57 275.24 0 top
NOREF#212  -  [Pad_e797]  14.3 309.3 0 top
NOREF#213  -  [Pad_e4213]  133.32 208.28 0 top
NOREF#214  -  [Pad_e5093]  202.98 71.62 0 top
NOREF#215  -  [Pad_e101]  94.75 376.49 0 top
NOREF#216  -  [Pad_e815]  84.09 273.84 0 top
NRF96W  -  [WIRELM-SMD_16P-L16.0-W16.0-P2.00_LORA-CC68-915MHZ-TCXO]  92.72 387.54 270 top
NRF96W#2  -  [WIRELM-SMD_16P-L16.0-W16.0-P2.00_LORA-CC68-915MHZ-TCXO]  132.17 387.5 270 top
NRF96W#3  -  [WIRELM-SMD_16P-L16.0-W16.0-P2.00_LORA-CC68-915MHZ-TCXO]  172.17 387.37 270 top
NRF96W#4  -  [WIRELM-SMD_16P-L16.0-W16.0-P2.00_LORA-CC68-915MHZ-TCXO]  212.11 386.99 270 top
NRF96W#5  -  [WIRELM-SMD_16P-L16.0-W16.0-P2.00_LORA-CC68-915MHZ-TCXO]  12.77 388.05 270 top
NRF96W#6  -  [WIRELM-SMD_16P-L16.0-W16.0-P2.00_LORA-CC68-915MHZ-TCXO]  12.78 354.5 270 top
NRF96W#7  -  [WIRELM-SMD_16P-L16.0-W16.0-P2.00_LORA-CC68-915MHZ-TCXO]  52.78 354.37 270 top
NRF96W#8  -  [WIRELM-SMD_16P-L16.0-W16.0-P2.00_LORA-CC68-915MHZ-TCXO]  92.72 353.99 270 top
NRF96W#9  -  [WIRELM-SMD_16P-L16.0-W16.0-P2.00_LORA-CC68-915MHZ-TCXO]  132.17 353.95 270 top
NRF96W#10  -  [WIRELM-SMD_16P-L16.0-W16.0-P2.00_LORA-CC68-915MHZ-TCXO]  172.18 353.82 270 top
NRF96W#11  -  [WIRELM-SMD_16P-L16.0-W16.0-P2.00_LORA-CC68-915MHZ-TCXO]  212.12 353.44 270 top
NRF96W#12  -  [WIRELM-SMD_16P-L16.0-W16.0-P2.00_LORA-CC68-915MHZ-TCXO]  11.38 185.73 270 top
NRF96W#13  -  [WIRELM-SMD_16P-L16.0-W16.0-P2.00_LORA-CC68-915MHZ-TCXO]  11.39 152.18 270 top
NRF96W#14  -  [WIRELM-SMD_16P-L16.0-W16.0-P2.00_LORA-CC68-915MHZ-TCXO]  11.88 253.43 270 top
NRF96W#15  -  [WIRELM-SMD_16P-L16.0-W16.0-P2.00_LORA-CC68-915MHZ-TCXO]  11.89 219.88 270 top
NRF96W#16  -  [WIRELM-SMD_16P-L16.0-W16.0-P2.00_LORA-CC68-915MHZ-TCXO]  51.38 185.6 270 top
NRF96W#17  -  [WIRELM-SMD_16P-L16.0-W16.0-P2.00_LORA-CC68-915MHZ-TCXO]  51.39 152.05 270 top
NRF96W#18  -  [WIRELM-SMD_16P-L16.0-W16.0-P2.00_LORA-CC68-915MHZ-TCXO]  51.89 253.3 270 top
NRF96W#19  -  [WIRELM-SMD_16P-L16.0-W16.0-P2.00_LORA-CC68-915MHZ-TCXO]  51.9 219.75 270 top
NRF96W#20  -  [WIRELM-SMD_16P-L16.0-W16.0-P2.00_LORA-CC68-915MHZ-TCXO]  91.32 185.22 270 top
NRF96W#21  -  [WIRELM-SMD_16P-L16.0-W16.0-P2.00_LORA-CC68-915MHZ-TCXO]  91.33 151.67 270 top
NRF96W#22  -  [WIRELM-SMD_16P-L16.0-W16.0-P2.00_LORA-CC68-915MHZ-TCXO]  91.83 252.92 270 top
NRF96W#23  -  [WIRELM-SMD_16P-L16.0-W16.0-P2.00_LORA-CC68-915MHZ-TCXO]  91.84 219.37 270 top
NRF96W#24  -  [WIRELM-SMD_16P-L16.0-W16.0-P2.00_LORA-CC68-915MHZ-TCXO]  130.77 185.17 270 top
NRF96W#25  -  [WIRELM-SMD_16P-L16.0-W16.0-P2.00_LORA-CC68-915MHZ-TCXO]  130.78 151.62 270 top
NRF96W#26  -  [WIRELM-SMD_16P-L16.0-W16.0-P2.00_LORA-CC68-915MHZ-TCXO]  131.28 252.88 270 top
NRF96W#27  -  [WIRELM-SMD_16P-L16.0-W16.0-P2.00_LORA-CC68-915MHZ-TCXO]  131.29 219.33 270 top
NRF96W#28  -  [WIRELM-SMD_16P-L16.0-W16.0-P2.00_LORA-CC68-915MHZ-TCXO]  170.78 185.05 270 top
NRF96W#29  -  [WIRELM-SMD_16P-L16.0-W16.0-P2.00_LORA-CC68-915MHZ-TCXO]  170.79 151.5 270 top
NRF96W#30  -  [WIRELM-SMD_16P-L16.0-W16.0-P2.00_LORA-CC68-915MHZ-TCXO]  171.28 252.75 270 top
NRF96W#31  -  [WIRELM-SMD_16P-L16.0-W16.0-P2.00_LORA-CC68-915MHZ-TCXO]  171.29 219.2 270 top
NRF96W#32  -  [WIRELM-SMD_16P-L16.0-W16.0-P2.00_LORA-CC68-915MHZ-TCXO]  210.72 184.67 270 top
NRF96W#33  -  [WIRELM-SMD_16P-L16.0-W16.0-P2.00_LORA-CC68-915MHZ-TCXO]  210.73 151.11 270 top
NRF96W#34  -  [WIRELM-SMD_16P-L16.0-W16.0-P2.00_LORA-CC68-915MHZ-TCXO]  211.22 252.37 270 top
NRF96W#35  -  [WIRELM-SMD_16P-L16.0-W16.0-P2.00_LORA-CC68-915MHZ-TCXO]  211.23 218.82 270 top
NRF96W#36  -  [WIRELM-SMD_16P-L16.0-W16.0-P2.00_LORA-CC68-915MHZ-TCXO]  131.67 286.24 270 top
NRF96W#37  -  [WIRELM-SMD_16P-L16.0-W16.0-P2.00_LORA-CC68-915MHZ-TCXO]  11.25 50.98 270 top
NRF96W#38  -  [WIRELM-SMD_16P-L16.0-W16.0-P2.00_LORA-CC68-915MHZ-TCXO]  11.26 17.43 270 top
NRF96W#39  -  [WIRELM-SMD_16P-L16.0-W16.0-P2.00_LORA-CC68-915MHZ-TCXO]  11.76 118.68 270 top
NRF96W#40  -  [WIRELM-SMD_16P-L16.0-W16.0-P2.00_LORA-CC68-915MHZ-TCXO]  11.76 85.13 270 top
NRF96W#41  -  [WIRELM-SMD_16P-L16.0-W16.0-P2.00_LORA-CC68-915MHZ-TCXO]  51.26 50.85 270 top
NRF96W#42  -  [WIRELM-SMD_16P-L16.0-W16.0-P2.00_LORA-CC68-915MHZ-TCXO]  51.26 17.3 270 top
NRF96W#43  -  [WIRELM-SMD_16P-L16.0-W16.0-P2.00_LORA-CC68-915MHZ-TCXO]  51.76 118.55 270 top
NRF96W#44  -  [WIRELM-SMD_16P-L16.0-W16.0-P2.00_LORA-CC68-915MHZ-TCXO]  51.77 85 270 top
NRF96W#45  -  [WIRELM-SMD_16P-L16.0-W16.0-P2.00_LORA-CC68-915MHZ-TCXO]  91.2 50.47 270 top
NRF96W#46  -  [WIRELM-SMD_16P-L16.0-W16.0-P2.00_LORA-CC68-915MHZ-TCXO]  91.2 16.92 270 top
NRF96W#47  -  [WIRELM-SMD_16P-L16.0-W16.0-P2.00_LORA-CC68-915MHZ-TCXO]  91.7 118.17 270 top
NRF96W#48  -  [WIRELM-SMD_16P-L16.0-W16.0-P2.00_LORA-CC68-915MHZ-TCXO]  91.71 84.62 270 top
NRF96W#49  -  [WIRELM-SMD_16P-L16.0-W16.0-P2.00_LORA-CC68-915MHZ-TCXO]  130.65 50.43 270 top
NRF96W#50  -  [WIRELM-SMD_16P-L16.0-W16.0-P2.00_LORA-CC68-915MHZ-TCXO]  130.65 16.88 270 top
NRF96W#51  -  [WIRELM-SMD_16P-L16.0-W16.0-P2.00_LORA-CC68-915MHZ-TCXO]  131.15 118.13 270 top
NRF96W#52  -  [WIRELM-SMD_16P-L16.0-W16.0-P2.00_LORA-CC68-915MHZ-TCXO]  131.16 84.58 270 top
NRF96W#53  -  [WIRELM-SMD_16P-L16.0-W16.0-P2.00_LORA-CC68-915MHZ-TCXO]  170.65 50.3 270 top
NRF96W#54  -  [WIRELM-SMD_16P-L16.0-W16.0-P2.00_LORA-CC68-915MHZ-TCXO]  170.66 16.75 270 top
NRF96W#55  -  [WIRELM-SMD_16P-L16.0-W16.0-P2.00_LORA-CC68-915MHZ-TCXO]  171.16 118 270 top
NRF96W#56  -  [WIRELM-SMD_16P-L16.0-W16.0-P2.00_LORA-CC68-915MHZ-TCXO]  171.16 84.45 270 top
NRF96W#57  -  [WIRELM-SMD_16P-L16.0-W16.0-P2.00_LORA-CC68-915MHZ-TCXO]  210.59 49.92 270 top
NRF96W#58  -  [WIRELM-SMD_16P-L16.0-W16.0-P2.00_LORA-CC68-915MHZ-TCXO]  210.6 16.37 270 top
NRF96W#59  -  [WIRELM-SMD_16P-L16.0-W16.0-P2.00_LORA-CC68-915MHZ-TCXO]  211.1 117.62 270 top
NRF96W#60  -  [WIRELM-SMD_16P-L16.0-W16.0-P2.00_LORA-CC68-915MHZ-TCXO]  211.1 84.07 270 top
NRF96W#61  -  [WIRELM-SMD_16P-L16.0-W16.0-P2.00_LORA-CC68-915MHZ-TCXO]  52.78 387.92 270 top
NRF96W#62  -  [WIRELM-SMD_16P-L16.0-W16.0-P2.00_LORA-CC68-915MHZ-TCXO]  12.27 320.35 270 top
NRF96W#63  -  [WIRELM-SMD_16P-L16.0-W16.0-P2.00_LORA-CC68-915MHZ-TCXO]  52.27 320.22 270 top
NRF96W#64  -  [WIRELM-SMD_16P-L16.0-W16.0-P2.00_LORA-CC68-915MHZ-TCXO]  92.21 319.84 270 top
NRF96W#65  -  [WIRELM-SMD_16P-L16.0-W16.0-P2.00_LORA-CC68-915MHZ-TCXO]  131.66 319.79 270 top
NRF96W#66  -  [WIRELM-SMD_16P-L16.0-W16.0-P2.00_LORA-CC68-915MHZ-TCXO]  171.67 319.67 270 top
NRF96W#67  -  [WIRELM-SMD_16P-L16.0-W16.0-P2.00_LORA-CC68-915MHZ-TCXO]  211.61 319.29 270 top
NRF96W#68  -  [WIRELM-SMD_16P-L16.0-W16.0-P2.00_LORA-CC68-915MHZ-TCXO]  12.28 286.8 270 top
NRF96W#69  -  [WIRELM-SMD_16P-L16.0-W16.0-P2.00_LORA-CC68-915MHZ-TCXO]  52.28 286.67 270 top
NRF96W#70  -  [WIRELM-SMD_16P-L16.0-W16.0-P2.00_LORA-CC68-915MHZ-TCXO]  92.22 286.29 270 top
NRF96W#71  -  [WIRELM-SMD_16P-L16.0-W16.0-P2.00_LORA-CC68-915MHZ-TCXO]  171.68 286.12 270 top
NRF96W#72  -  [WIRELM-SMD_16P-L16.0-W16.0-P2.00_LORA-CC68-915MHZ-TCXO]  211.62 285.74 270 top

## Footprints (pads in the part's own frame, mm; a bottom-side part is the same pattern mirrored in y, then rotated)
CAP-TH_BD5.0-P2.00-D0.5-FD
  round 1.1 hole 0.7: 1(-1,0) 2(1,0)
HDR-TH_4P-HX-PH254-01-04-Z-L11.5
  rect 1.62x1.62 hole 1.02: 1(-3.81,0)
  round 1.62 hole 1.02: 2(-1.27,0) 3(1.27,0) 4(3.81,0)
Pad_e29
  round 1.524 hole 0.914: 2(0,0)
Pad_e30
  round 1.524 hole 0.914: 1(0,0)
Pad_e31
  round 1.524 hole 0.914: 1(0,0)
Pad_e65
  round 1.524 hole 0.914: 2(0,0)
Pad_e66
  round 1.524 hole 0.914: 1(0,0)
Pad_e67
  round 1.524 hole 0.914: 1(0,0)
Pad_e101
  round 1.524 hole 0.914: 2(0,0)
Pad_e102
  round 1.524 hole 0.914: 1(0,0)
Pad_e103
  round 1.524 hole 0.914: 1(0,0)
Pad_e195
  round 1.524 hole 0.914: 1(0,0)
Pad_e196
  round 1.524 hole 0.914: 1(0,0)
Pad_e197
  round 1.524 hole 0.914: 2(0,0)
Pad_e198
  round 1.524 hole 0.914: 2(0,0)
Pad_e199
  round 1.524 hole 0.914: 1(0,0)
Pad_e200
  round 1.524 hole 0.914: 1(0,0)
Pad_e201
  round 1.524 hole 0.914: 2(0,0)
Pad_e202
  round 1.524 hole 0.914: 1(0,0)
Pad_e203
  round 1.524 hole 0.914: 1(0,0)
Pad_e390
  round 1.524 hole 0.914: 1(0,0)
Pad_e391
  round 1.524 hole 0.914: 1(0,0)
Pad_e392
  round 1.524 hole 0.914: 2(0,0)
Pad_e393
  round 1.524 hole 0.914: 1(0,0)
Pad_e394
  round 1.524 hole 0.914: 2(0,0)
Pad_e395
  round 1.524 hole 0.914: 1(0,0)
Pad_e396
  round 1.524 hole 0.914: 1(0,0)
Pad_e397
  round 1.524 hole 0.914: 2(0,0)
Pad_e398
  round 1.524 hole 0.914: 1(0,0)
Pad_e399
  round 1.524 hole 0.914: 1(0,0)
Pad_e400
  round 1.524 hole 0.914: 2(0,0)
Pad_e401
  round 1.524 hole 0.914: 1(0,0)
Pad_e402
  round 1.524 hole 0.914: 2(0,0)
Pad_e403
  round 1.524 hole 0.914: 1(0,0)
Pad_e404
  round 1.524 hole 0.914: 1(0,0)
Pad_e405
  round 1.524 hole 0.914: 2(0,0)
Pad_e406
  round 1.524 hole 0.914: 1(0,0)
Pad_e407
  round 1.524 hole 0.914: 1(0,0)
Pad_e780
  round 1.524 hole 0.914: 1(0,0)
Pad_e781
  round 1.524 hole 0.914: 2(0,0)
Pad_e782
  round 1.524 hole 0.914: 1(0,0)
Pad_e783
  round 1.524 hole 0.914: 1(0,0)
Pad_e784
  round 1.524 hole 0.914: 2(0,0)
Pad_e785
  round 1.524 hole 0.914: 1(0,0)
Pad_e786
  round 1.524 hole 0.914: 2(0,0)
Pad_e787
  round 1.524 hole 0.914: 1(0,0)
Pad_e788
  round 1.524 hole 0.914: 2(0,0)
Pad_e789
  round 1.524 hole 0.914: 1(0,0)
Pad_e790
  round 1.524 hole 0.914: 1(0,0)
Pad_e791
  round 1.524 hole 0.914: 2(0,0)
Pad_e792
  round 1.524 hole 0.914: 1(0,0)
Pad_e793
  round 1.524 hole 0.914: 1(0,0)
Pad_e794
  round 1.524 hole 0.914: 2(0,0)
Pad_e795
  round 1.524 hole 0.914: 1(0,0)
Pad_e796
  round 1.524 hole 0.914: 1(0,0)
Pad_e797
  round 1.524 hole 0.914: 2(0,0)
Pad_e798
  round 1.524 hole 0.914: 1(0,0)
Pad_e799
  round 1.524 hole 0.914: 1(0,0)
Pad_e800
  round 1.524 hole 0.914: 1(0,0)
Pad_e801
  round 1.524 hole 0.914: 2(0,0)
Pad_e802
  round 1.524 hole 0.914: 1(0,0)
Pad_e803
  round 1.524 hole 0.914: 2(0,0)
Pad_e804
  round 1.524 hole 0.914: 1(0,0)
Pad_e805
  round 1.524 hole 0.914: 1(0,0)
Pad_e806
  round 1.524 hole 0.914: 2(0,0)
Pad_e807
  round 1.524 hole 0.914: 1(0,0)
Pad_e808
  round 1.524 hole 0.914: 1(0,0)
Pad_e809
  round 1.524 hole 0.914: 1(0,0)
Pad_e810
  round 1.524 hole 0.914: 1(0,0)
Pad_e811
  round 1.524 hole 0.914: 2(0,0)
Pad_e812
  round 1.524 hole 0.914: 1(0,0)
Pad_e813
  round 1.524 hole 0.914: 1(0,0)
Pad_e814
  round 1.524 hole 0.914: 2(0,0)
Pad_e815
  round 1.524 hole 0.914: 1(0,0)
Pad_e4166
  round 1.524 hole 0.914: 1(0,0)
Pad_e4167
  round 1.524 hole 0.914: 1(0,0)
Pad_e4168
  round 1.524 hole 0.914: 1(0,0)
Pad_e4169
  round 1.524 hole 0.914: 1(0,0)
Pad_e4170
  round 1.524 hole 0.914: 1(0,0)
Pad_e4171
  round 1.524 hole 0.914: 1(0,0)
Pad_e4172
  round 1.524 hole 0.914: 1(0,0)
Pad_e4173
  round 1.524 hole 0.914: 1(0,0)
Pad_e4174
  round 1.524 hole 0.914: 2(0,0)
Pad_e4175
  round 1.524 hole 0.914: 2(0,0)
Pad_e4176
  round 1.524 hole 0.914: 2(0,0)
Pad_e4177
  round 1.524 hole 0.914: 2(0,0)
Pad_e4178
  round 1.524 hole 0.914: 1(0,0)
Pad_e4179
  round 1.524 hole 0.914: 1(0,0)
Pad_e4180
  round 1.524 hole 0.914: 1(0,0)
Pad_e4181
  round 1.524 hole 0.914: 1(0,0)
Pad_e4182
  round 1.524 hole 0.914: 1(0,0)
Pad_e4183
  round 1.524 hole 0.914: 1(0,0)
Pad_e4184
  round 1.524 hole 0.914: 1(0,0)
Pad_e4185
  round 1.524 hole 0.914: 1(0,0)
Pad_e4186
  round 1.524 hole 0.914: 2(0,0)
Pad_e4187
  round 1.524 hole 0.914: 2(0,0)
Pad_e4188
  round 1.524 hole 0.914: 2(0,0)
Pad_e4189
  round 1.524 hole 0.914: 2(0,0)
Pad_e4190
  round 1.524 hole 0.914: 1(0,0)
Pad_e4191
  round 1.524 hole 0.914: 1(0,0)
Pad_e4192
  round 1.524 hole 0.914: 1(0,0)
Pad_e4193
  round 1.524 hole 0.914: 1(0,0)
Pad_e4194
  round 1.524 hole 0.914: 1(0,0)
Pad_e4195
  round 1.524 hole 0.914: 1(0,0)
Pad_e4196
  round 1.524 hole 0.914: 1(0,0)
Pad_e4197
  round 1.524 hole 0.914: 1(0,0)
Pad_e4198
  round 1.524 hole 0.914: 2(0,0)
Pad_e4199
  round 1.524 hole 0.914: 2(0,0)
Pad_e4200
  round 1.524 hole 0.914: 2(0,0)
Pad_e4201
  round 1.524 hole 0.914: 2(0,0)
Pad_e4202
  round 1.524 hole 0.914: 1(0,0)
Pad_e4203
  round 1.524 hole 0.914: 1(0,0)
Pad_e4204
  round 1.524 hole 0.914: 1(0,0)
Pad_e4205
  round 1.524 hole 0.914: 1(0,0)
Pad_e4206
  round 1.524 hole 0.914: 1(0,0)
Pad_e4207
  round 1.524 hole 0.914: 1(0,0)
Pad_e4208
  round 1.524 hole 0.914: 1(0,0)
Pad_e4209
  round 1.524 hole 0.914: 1(0,0)
Pad_e4210
  round 1.524 hole 0.914: 2(0,0)
Pad_e4211
  round 1.524 hole 0.914: 2(0,0)
Pad_e4212
  round 1.524 hole 0.914: 2(0,0)
Pad_e4213
  round 1.524 hole 0.914: 2(0,0)
Pad_e4214
  round 1.524 hole 0.914: 1(0,0)
Pad_e4215
  round 1.524 hole 0.914: 1(0,0)
Pad_e4216
  round 1.524 hole 0.914: 1(0,0)
Pad_e4217
  round 1.524 hole 0.914: 1(0,0)
Pad_e4218
  round 1.524 hole 0.914: 1(0,0)
Pad_e4219
  round 1.524 hole 0.914: 1(0,0)
Pad_e4220
  round 1.524 hole 0.914: 1(0,0)
Pad_e4221
  round 1.524 hole 0.914: 1(0,0)
Pad_e4222
  round 1.524 hole 0.914: 2(0,0)
Pad_e4223
  round 1.524 hole 0.914: 2(0,0)
Pad_e4224
  round 1.524 hole 0.914: 2(0,0)
Pad_e4225
  round 1.524 hole 0.914: 2(0,0)
Pad_e4226
  round 1.524 hole 0.914: 1(0,0)
Pad_e4227
  round 1.524 hole 0.914: 1(0,0)
Pad_e4228
  round 1.524 hole 0.914: 1(0,0)
Pad_e4229
  round 1.524 hole 0.914: 1(0,0)
Pad_e4230
  round 1.524 hole 0.914: 1(0,0)
Pad_e4231
  round 1.524 hole 0.914: 1(0,0)
Pad_e4232
  round 1.524 hole 0.914: 1(0,0)
Pad_e4233
  round 1.524 hole 0.914: 1(0,0)
Pad_e4234
  round 1.524 hole 0.914: 2(0,0)
Pad_e4235
  round 1.524 hole 0.914: 2(0,0)
Pad_e4236
  round 1.524 hole 0.914: 2(0,0)
Pad_e4237
  round 1.524 hole 0.914: 2(0,0)
Pad_e5030
  round 1.524 hole 0.914: 1(0,0)
Pad_e5031
  round 1.524 hole 0.914: 1(0,0)
Pad_e5032
  round 1.524 hole 0.914: 1(0,0)
Pad_e5033
  round 1.524 hole 0.914: 1(0,0)
Pad_e5034
  round 1.524 hole 0.914: 1(0,0)
Pad_e5035
  round 1.524 hole 0.914: 1(0,0)
Pad_e5036
  round 1.524 hole 0.914: 1(0,0)
Pad_e5037
  round 1.524 hole 0.914: 1(0,0)
Pad_e5038
  round 1.524 hole 0.914: 2(0,0)
Pad_e5039
  round 1.524 hole 0.914: 2(0,0)
Pad_e5040
  round 1.524 hole 0.914: 2(0,0)
Pad_e5041
  round 1.524 hole 0.914: 2(0,0)
Pad_e5042
  round 1.524 hole 0.914: 1(0,0)
Pad_e5043
  round 1.524 hole 0.914: 1(0,0)
Pad_e5044
  round 1.524 hole 0.914: 1(0,0)
Pad_e5045
  round 1.524 hole 0.914: 1(0,0)
Pad_e5046
  round 1.524 hole 0.914: 1(0,0)
Pad_e5047
  round 1.524 hole 0.914: 1(0,0)
Pad_e5048
  round 1.524 hole 0.914: 1(0,0)
Pad_e5049
  round 1.524 hole 0.914: 1(0,0)
Pad_e5050
  round 1.524 hole 0.914: 2(0,0)
Pad_e5051
  round 1.524 hole 0.914: 2(0,0)
Pad_e5052
  round 1.524 hole 0.914: 2(0,0)
Pad_e5053
  round 1.524 hole 0.914: 2(0,0)
Pad_e5054
  round 1.524 hole 0.914: 1(0,0)
Pad_e5055
  round 1.524 hole 0.914: 1(0,0)
Pad_e5056
  round 1.524 hole 0.914: 1(0,0)
Pad_e5057
  round 1.524 hole 0.914: 1(0,0)
Pad_e5058
  round 1.524 hole 0.914: 1(0,0)
Pad_e5059
  round 1.524 hole 0.914: 1(0,0)
Pad_e5060
  round 1.524 hole 0.914: 1(0,0)
Pad_e5061
  round 1.524 hole 0.914: 1(0,0)
Pad_e5062
  round 1.524 hole 0.914: 2(0,0)
Pad_e5063
  round 1.524 hole 0.914: 2(0,0)
Pad_e5064
  round 1.524 hole 0.914: 2(0,0)
Pad_e5065
  round 1.524 hole 0.914: 2(0,0)
Pad_e5066
  round 1.524 hole 0.914: 1(0,0)
Pad_e5067
  round 1.524 hole 0.914: 1(0,0)
Pad_e5068
  round 1.524 hole 0.914: 1(0,0)
Pad_e5069
  round 1.524 hole 0.914: 1(0,0)
Pad_e5070
  round 1.524 hole 0.914: 1(0,0)
Pad_e5071
  round 1.524 hole 0.914: 1(0,0)
Pad_e5072
  round 1.524 hole 0.914: 1(0,0)
Pad_e5073
  round 1.524 hole 0.914: 1(0,0)
Pad_e5074
  round 1.524 hole 0.914: 2(0,0)
Pad_e5075
  round 1.524 hole 0.914: 2(0,0)
Pad_e5076
  round 1.524 hole 0.914: 2(0,0)
Pad_e5077
  round 1.524 hole 0.914: 2(0,0)
Pad_e5078
  round 1.524 hole 0.914: 1(0,0)
Pad_e5079
  round 1.524 hole 0.914: 1(0,0)
Pad_e5080
  round 1.524 hole 0.914: 1(0,0)
Pad_e5081
  round 1.524 hole 0.914: 1(0,0)
Pad_e5082
  round 1.524 hole 0.914: 1(0,0)
Pad_e5083
  round 1.524 hole 0.914: 1(0,0)
Pad_e5084
  round 1.524 hole 0.914: 1(0,0)
Pad_e5085
  round 1.524 hole 0.914: 1(0,0)
Pad_e5086
  round 1.524 hole 0.914: 2(0,0)
Pad_e5087
  round 1.524 hole 0.914: 2(0,0)
Pad_e5088
  round 1.524 hole 0.914: 2(0,0)
Pad_e5089
  round 1.524 hole 0.914: 2(0,0)
Pad_e5090
  round 1.524 hole 0.914: 1(0,0)
Pad_e5091
  round 1.524 hole 0.914: 1(0,0)
Pad_e5092
  round 1.524 hole 0.914: 1(0,0)
Pad_e5093
  round 1.524 hole 0.914: 1(0,0)
Pad_e5094
  round 1.524 hole 0.914: 1(0,0)
Pad_e5095
  round 1.524 hole 0.914: 1(0,0)
Pad_e5096
  round 1.524 hole 0.914: 1(0,0)
Pad_e5097
  round 1.524 hole 0.914: 1(0,0)
Pad_e5098
  round 1.524 hole 0.914: 2(0,0)
Pad_e5099
  round 1.524 hole 0.914: 2(0,0)
Pad_e5100
  round 1.524 hole 0.914: 2(0,0)
Pad_e5101
  round 1.524 hole 0.914: 2(0,0)
WIRELM-SMD_16P-L16.0-W16.0-P2.00_LORA-CC68-915MHZ-TCXO
  rect 2x1.2 smd: 1(-8,7) 2(-8,5) 3(-8,3) 4(-8,1) 5(-8,-1) 6(-8,-3) 7(-8,-5) 8(-8,-7) 9(8,-7) 10(8,-5) 11(8,-3) 12(8,-1) 13(8,1) 14(8,3) 15(8,5) 16(8,7)

## Nets
3.3V: H2.4 H2#2.4 H2#3.4 H2#4.4 H2#5.4 H2#6.4 H2#7.4 H2#8.4 H2#9.4 H2#10.4 H2#11.4 H2#12.4 H2#13.4 H2#14.4 H2#15.4 H2#16.4 H2#17.4 H2#18.4 H2#19.4 H2#20.4 H2#21.4 H2#22.4 H2#23.4 H2#24.4 H2#25.4 H2#26.4 H2#27.4 H2#28.4 H2#29.4 H2#30.4 H2#31.4 H2#32.4 H2#33.4 H2#34.4 H2#35.4 H2#36.4 H2#37.4 H2#38.4 H2#39.4 H2#40.4 H2#41.4 H2#42.4 H2#43.4 H2#44.4 H2#45.4 H2#46.4 H2#47.4 H2#48.4 H2#49.4 H2#50.4 H2#51.4 H2#52.4 H2#53.4 H2#54.4 H2#55.4 H2#56.4 H2#57.4 H2#58.4 H2#59.4 H2#60.4 H2#61.4 H2#62.4 H2#63.4 H2#64.4 H2#65.4 H2#66.4 H2#67.4 H2#68.4 H2#69.4 H2#70.4 H2#71.4 H2#72.4 NRF96W.13 NRF96W#2.13 NRF96W#3.13 NRF96W#4.13 NRF96W#5.13 NRF96W#6.13 NRF96W#7.13 NRF96W#8.13 NRF96W#9.13 NRF96W#10.13 NRF96W#11.13 NRF96W#12.13 NRF96W#13.13 NRF96W#14.13 NRF96W#15.13 NRF96W#16.13 NRF96W#17.13 NRF96W#18.13 NRF96W#19.13 NRF96W#20.13 NRF96W#21.13 NRF96W#22.13 NRF96W#23.13 NRF96W#24.13 NRF96W#25.13 NRF96W#26.13 NRF96W#27.13 NRF96W#28.13 NRF96W#29.13 NRF96W#30.13 NRF96W#31.13 NRF96W#32.13 NRF96W#33.13 NRF96W#34.13 NRF96W#35.13 NRF96W#36.13 NRF96W#37.13 NRF96W#38.13 NRF96W#39.13 NRF96W#40.13 NRF96W#41.13 NRF96W#42.13 NRF96W#43.13 NRF96W#44.13 NRF96W#45.13 NRF96W#46.13 NRF96W#47.13 NRF96W#48.13 NRF96W#49.13 NRF96W#50.13 NRF96W#51.13 NRF96W#52.13 NRF96W#53.13 NRF96W#54.13 NRF96W#55.13 NRF96W#56.13 NRF96W#57.13 NRF96W#58.13 NRF96W#59.13 NRF96W#60.13 NRF96W#61.13 NRF96W#62.13 NRF96W#63.13 NRF96W#64.13 NRF96W#65.13 NRF96W#66.13 NRF96W#67.13 NRF96W#68.13 NRF96W#69.13 NRF96W#70.13 NRF96W#71.13 NRF96W#72.13
GND: H1.1 H1#2.1 H1#3.1 H1#4.1 H1#5.1 H1#6.1 H1#7.1 H1#8.1 H1#9.1 H1#10.1 H1#11.1 H1#12.1 H1#13.1 H1#14.1 H1#15.1 H1#16.1 H1#17.1 H1#18.1 H1#19.1 H1#20.1 H1#21.1 H1#22.1 H1#23.1 H1#24.1 H1#25.1 H1#26.1 H1#27.1 H1#28.1 H1#29.1 H1#30.1 H1#31.1 H1#32.1 H1#33.1 H1#34.1 H1#35.1 H1#36.1 H1#37.1 H1#38.1 H1#39.1 H1#40.1 H1#41.1 H1#42.1 H1#43.1 H1#44.1 H1#45.1 H1#46.1 H1#47.1 H1#48.1 H1#49.1 H1#50.1 H1#51.1 H1#52.1 H1#53.1 H1#54.1 H1#55.1 H1#56.1 H1#57.1 H1#58.1 H1#59.1 H1#60.1 H1#61.1 H1#62.1 H1#63.1 H1#64.1 H1#65.1 H1#66.1 H1#67.1 H1#68.1 H1#69.1 H1#70.1 H1#71.1 H1#72.1 NRF96W.10 NRF96W#2.10 NRF96W#3.10 NRF96W#4.10 NRF96W#5.10 NRF96W#6.10 NRF96W#7.10 NRF96W#8.10 NRF96W#9.10 NRF96W#10.10 NRF96W#11.10 NRF96W#12.10 NRF96W#13.10 NRF96W#14.10 NRF96W#15.10 NRF96W#16.10 NRF96W#17.10 NRF96W#18.10 NRF96W#19.10 NRF96W#20.10 NRF96W#21.10 NRF96W#22.10 NRF96W#23.10 NRF96W#24.10 NRF96W#25.10 NRF96W#26.10 NRF96W#27.10 NRF96W#28.10 NRF96W#29.10 NRF96W#30.10 NRF96W#31.10 NRF96W#32.10 NRF96W#33.10 NRF96W#34.10 NRF96W#35.10 NRF96W#36.10 NRF96W#37.10 NRF96W#38.10 NRF96W#39.10 NRF96W#40.10 NRF96W#41.10 NRF96W#42.10 NRF96W#43.10 NRF96W#44.10 NRF96W#45.10 NRF96W#46.10 NRF96W#47.10 NRF96W#48.10 NRF96W#49.10 NRF96W#50.10 NRF96W#51.10 NRF96W#52.10 NRF96W#53.10 NRF96W#54.10 NRF96W#55.10 NRF96W#56.10 NRF96W#57.10 NRF96W#58.10 NRF96W#59.10 NRF96W#60.10 NRF96W#61.10 NRF96W#62.10 NRF96W#63.10 NRF96W#64.10 NRF96W#65.10 NRF96W#66.10 NRF96W#67.10 NRF96W#68.10 NRF96W#69.10 NRF96W#70.10 NRF96W#71.10 NRF96W#72.10
DIO0: H2.1 H2#2.1 H2#3.1 H2#4.1 H2#5.1 H2#6.1 H2#7.1 H2#8.1 H2#9.1 H2#10.1 H2#11.1 H2#12.1 H2#13.1 H2#14.1 H2#15.1 H2#16.1 H2#17.1 H2#18.1 H2#19.1 H2#20.1 H2#21.1 H2#22.1 H2#23.1 H2#24.1 H2#25.1 H2#26.1 H2#27.1 H2#28.1 H2#29.1 H2#30.1 H2#31.1 H2#32.1 H2#33.1 H2#34.1 H2#35.1 H2#36.1 H2#37.1 H2#38.1 H2#39.1 H2#40.1 H2#41.1 H2#42.1 H2#43.1 H2#44.1 H2#45.1 H2#46.1 H2#47.1 H2#48.1 H2#49.1 H2#50.1 H2#51.1 H2#52.1 H2#53.1 H2#54.1 H2#55.1 H2#56.1 H2#57.1 H2#58.1 H2#59.1 H2#60.1 H2#61.1 H2#62.1 H2#63.1 H2#64.1 H2#65.1 H2#66.1 H2#67.1 H2#68.1 H2#69.1 H2#70.1 H2#71.1 H2#72.1 NRF96W.14 NRF96W#2.14 NRF96W#3.14 NRF96W#4.14 NRF96W#5.14 NRF96W#6.14 NRF96W#7.14 NRF96W#8.14 NRF96W#9.14 NRF96W#10.14 NRF96W#11.14 NRF96W#12.14 NRF96W#13.14 NRF96W#14.14 NRF96W#15.14 NRF96W#16.14 NRF96W#17.14 NRF96W#18.14 NRF96W#19.14 NRF96W#20.14 NRF96W#21.14 NRF96W#22.14 NRF96W#23.14 NRF96W#24.14 NRF96W#25.14 NRF96W#26.14 NRF96W#27.14 NRF96W#28.14 NRF96W#29.14 NRF96W#30.14 NRF96W#31.14 NRF96W#32.14 NRF96W#33.14 NRF96W#34.14 NRF96W#35.14 NRF96W#36.14 NRF96W#37.14 NRF96W#38.14 NRF96W#39.14 NRF96W#40.14 NRF96W#41.14 NRF96W#42.14 NRF96W#43.14 NRF96W#44.14 NRF96W#45.14 NRF96W#46.14 NRF96W#47.14 NRF96W#48.14 NRF96W#49.14 NRF96W#50.14 NRF96W#51.14 NRF96W#52.14 NRF96W#53.14 NRF96W#54.14 NRF96W#55.14 NRF96W#56.14 NRF96W#57.14 NRF96W#58.14 NRF96W#59.14 NRF96W#60.14 NRF96W#61.14 NRF96W#62.14 NRF96W#63.14 NRF96W#64.14 NRF96W#65.14 NRF96W#66.14 NRF96W#67.14 NRF96W#68.14 NRF96W#69.14 NRF96W#70.14 NRF96W#71.14 NRF96W#72.14
MISO: H1.4 H1#2.4 H1#3.4 H1#4.4 H1#5.4 H1#6.4 H1#7.4 H1#8.4 H1#9.4 H1#10.4 H1#11.4 H1#12.4 H1#13.4 H1#14.4 H1#15.4 H1#16.4 H1#17.4 H1#18.4 H1#19.4 H1#20.4 H1#21.4 H1#22.4 H1#23.4 H1#24.4 H1#25.4 H1#26.4 H1#27.4 H1#28.4 H1#29.4 H1#30.4 H1#31.4 H1#32.4 H1#33.4 H1#34.4 H1#35.4 H1#36.4 H1#37.4 H1#38.4 H1#39.4 H1#40.4 H1#41.4 H1#42.4 H1#43.4 H1#44.4 H1#45.4 H1#46.4 H1#47.4 H1#48.4 H1#49.4 H1#50.4 H1#51.4 H1#52.4 H1#53.4 H1#54.4 H1#55.4 H1#56.4 H1#57.4 H1#58.4 H1#59.4 H1#60.4 H1#61.4 H1#62.4 H1#63.4 H1#64.4 H1#65.4 H1#66.4 H1#67.4 H1#68.4 H1#69.4 H1#70.4 H1#71.4 H1#72.4 NRF96W.2 NRF96W#2.2 NRF96W#3.2 NRF96W#4.2 NRF96W#5.2 NRF96W#6.2 NRF96W#7.2 NRF96W#8.2 NRF96W#9.2 NRF96W#10.2 NRF96W#11.2 NRF96W#12.2 NRF96W#13.2 NRF96W#14.2 NRF96W#15.2 NRF96W#16.2 NRF96W#17.2 NRF96W#18.2 NRF96W#19.2 NRF96W#20.2 NRF96W#21.2 NRF96W#22.2 NRF96W#23.2 NRF96W#24.2 NRF96W#25.2 NRF96W#26.2 NRF96W#27.2 NRF96W#28.2 NRF96W#29.2 NRF96W#30.2 NRF96W#31.2 NRF96W#32.2 NRF96W#33.2 NRF96W#34.2 NRF96W#35.2 NRF96W#36.2 NRF96W#37.2 NRF96W#38.2 NRF96W#39.2 NRF96W#40.2 NRF96W#41.2 NRF96W#42.2 NRF96W#43.2 NRF96W#44.2 NRF96W#45.2 NRF96W#46.2 NRF96W#47.2 NRF96W#48.2 NRF96W#49.2 NRF96W#50.2 NRF96W#51.2 NRF96W#52.2 NRF96W#53.2 NRF96W#54.2 NRF96W#55.2 NRF96W#56.2 NRF96W#57.2 NRF96W#58.2 NRF96W#59.2 NRF96W#60.2 NRF96W#61.2 NRF96W#62.2 NRF96W#63.2 NRF96W#64.2 NRF96W#65.2 NRF96W#66.2 NRF96W#67.2 NRF96W#68.2 NRF96W#69.2 NRF96W#70.2 NRF96W#71.2 NRF96W#72.2
MOSI: H2.2 H2#2.2 H2#3.2 H2#4.2 H2#5.2 H2#6.2 H2#7.2 H2#8.2 H2#9.2 H2#10.2 H2#11.2 H2#12.2 H2#13.2 H2#14.2 H2#15.2 H2#16.2 H2#17.2 H2#18.2 H2#19.2 H2#20.2 H2#21.2 H2#22.2 H2#23.2 H2#24.2 H2#25.2 H2#26.2 H2#27.2 H2#28.2 H2#29.2 H2#30.2 H2#31.2 H2#32.2 H2#33.2 H2#34.2 H2#35.2 H2#36.2 H2#37.2 H2#38.2 H2#39.2 H2#40.2 H2#41.2 H2#42.2 H2#43.2 H2#44.2 H2#45.2 H2#46.2 H2#47.2 H2#48.2 H2#49.2 H2#50.2 H2#51.2 H2#52.2 H2#53.2 H2#54.2 H2#55.2 H2#56.2 H2#57.2 H2#58.2 H2#59.2 H2#60.2 H2#61.2 H2#62.2 H2#63.2 H2#64.2 H2#65.2 H2#66.2 H2#67.2 H2#68.2 H2#69.2 H2#70.2 H2#71.2 H2#72.2 NRF96W.3 NRF96W#2.3 NRF96W#3.3 NRF96W#4.3 NRF96W#5.3 NRF96W#6.3 NRF96W#7.3 NRF96W#8.3 NRF96W#9.3 NRF96W#10.3 NRF96W#11.3 NRF96W#12.3 NRF96W#13.3 NRF96W#14.3 NRF96W#15.3 NRF96W#16.3 NRF96W#17.3 NRF96W#18.3 NRF96W#19.3 NRF96W#20.3 NRF96W#21.3 NRF96W#22.3 NRF96W#23.3 NRF96W#24.3 NRF96W#25.3 NRF96W#26.3 NRF96W#27.3 NRF96W#28.3 NRF96W#29.3 NRF96W#30.3 NRF96W#31.3 NRF96W#32.3 NRF96W#33.3 NRF96W#34.3 NRF96W#35.3 NRF96W#36.3 NRF96W#37.3 NRF96W#38.3 NRF96W#39.3 NRF96W#40.3 NRF96W#41.3 NRF96W#42.3 NRF96W#43.3 NRF96W#44.3 NRF96W#45.3 NRF96W#46.3 NRF96W#47.3 NRF96W#48.3 NRF96W#49.3 NRF96W#50.3 NRF96W#51.3 NRF96W#52.3 NRF96W#53.3 NRF96W#54.3 NRF96W#55.3 NRF96W#56.3 NRF96W#57.3 NRF96W#58.3 NRF96W#59.3 NRF96W#60.3 NRF96W#61.3 NRF96W#62.3 NRF96W#63.3 NRF96W#64.3 NRF96W#65.3 NRF96W#66.3 NRF96W#67.3 NRF96W#68.3 NRF96W#69.3 NRF96W#70.3 NRF96W#71.3 NRF96W#72.3

## Routing (per net, layer and track width the routed paths; a pad name or vN(x,y) marks a point on that pad's centre or on a via; arc(x,y) is an arc through that point)
3.3V: length 525.3
  Top Layer w0.508: 13.28,311.71 13.28,310.19 ; 13.39,312.95 13.39,318.08 9.22,321.36 6.93,322.89 2.62,325.3 2.62,331.14 4.9,333.43 32.08,333.43 33.22,332.28 33.22,319.57 31.08,318.44 28.34,318.44 27,317.17 ; 13.41,310.5 13.41,310.19 14.3,309.3 16.21,307.39 22.24,307.39 ; 13.79,379.41 13.79,377.89 ; 13.9,380.66 13.9,385.78 9.72,389.06 7.44,390.59 3.12,393 3.12,398.84 5.41,401.13 32.58,401.13 33.73,399.99 33.73,387.28 31.58,386.14 28.84,386.14 27.5,384.87 ; 13.92,378.21 13.92,377.89 14.8,377 16.71,375.09 22.75,375.09 ; 53.29,311.58 53.29,310.06 ; 53.4,312.83 53.4,317.95 49.22,321.24 46.94,322.76 42.62,325.17 42.62,331.01 44.91,333.3 72.08,333.3 73.23,332.16 73.23,319.45 71.08,318.31 68.34,318.31 67,317.04 ; 53.42,310.38 53.42,310.06 54.3,309.17 56.21,307.27 62.25,307.27 ; 53.79,379.29 53.79,377.76 ; 53.9,380.53 53.9,385.65 49.73,388.94 47.44,390.46 43.12,392.88 43.12,398.72 45.41,401 72.59,401 73.73,399.86 73.73,387.15 71.59,386.02 68.85,386.02 67.51,384.75 ; 53.92,378.08 53.92,377.76 54.81,376.87 56.71,374.97 62.75,374.97 ; 93.23,311.2 93.23,309.68 ; 93.34,312.45 93.34,317.57 89.16,320.85 86.88,322.38 82.56,324.79 82.56,330.63 84.85,332.92 112.02,332.92 113.17,331.78 113.17,319.07 111.02,317.93 108.28,317.93 106.94,316.66 ; 93.36,310 93.36,309.68 94.24,308.79 96.15,306.88 102.19,306.88 ; 93.73,378.9 93.73,377.38 ; 93.84,380.15 93.84,385.27 89.67,388.56 87.38,390.08 83.06,392.49 83.06,398.34 85.35,400.62 112.53,400.62 113.67,399.48 113.67,386.77 111.53,385.64 108.79,385.64 107.45,384.37 ; 93.86,377.7 93.86,377.38 94.75,376.49 96.65,374.59 102.69,374.59
GND: length 225.5
  Top Layer w0.508: 9.6,311.96 9.6,306.94 10.86,305.74 23.55,305.74 23.55,305.75 27.57,305.75 29.16,309.17 29.41,316.88 ; 10.11,379.67 10.11,374.64 11.37,373.44 24.06,373.44 24.06,373.45 28.08,373.45 29.66,376.87 29.92,384.58 ; 10.45,309.3 9.6,309.3 ; 10.95,377 10.1,377 ; 24.21,307.5 24.21,305.74 ; 24.71,375.21 24.71,373.44 ; 49.61,311.84 49.61,306.81 50.87,305.62 63.56,305.62 63.56,305.62 67.58,305.62 69.16,309.04 69.42,316.75 ; 50.11,379.54 50.11,374.51 51.37,373.32 64.06,373.32 64.06,373.32 68.08,373.32 69.67,376.75 69.92,384.45 ; 50.45,309.17 49.6,309.17 ; 50.96,376.87 50.11,376.87 ; 64.21,307.38 64.21,305.62 ; 64.72,375.08 64.72,373.32 ; 89.55,311.46 89.55,306.43 90.81,305.23 103.5,305.23 103.5,305.24 107.52,305.24 109.1,308.66 109.36,316.37 ; 90.05,379.16 90.05,374.13 91.31,372.94 104,372.94 104,372.94 108.02,372.94 109.61,376.37 109.86,384.07 ; 90.39,308.79 89.54,308.79 ; 90.9,376.49 90.05,376.49 ; 104.15,307 104.15,305.23 ; 104.65,374.7 104.65,372.94
DIO0: length 141
  Top Layer w0.254: 15.32,312.98 15.32,317.68 18.07,320.82 27.54,320.82 28.28,321.27 28.28,323.52 26.75,324.86 ; 15.82,380.68 15.82,385.38 18.58,388.52 28.04,388.52 28.78,388.97 28.78,391.22 27.25,392.56 ; 55.32,312.85 55.32,317.55 58.08,320.69 67.54,320.69 68.28,321.14 68.28,323.39 66.75,324.73 ; 55.83,380.56 55.83,385.25 58.58,388.4 68.05,388.4 68.79,388.85 68.79,391.09 67.25,392.43 ; 95.26,312.47 95.26,317.17 98.02,320.31 107.48,320.31 108.22,320.76 108.22,323.01 106.69,324.35 ; 95.76,380.17 95.76,384.87 98.52,388.01 107.99,388.01 108.73,388.46 108.73,390.71 107.19,392.05
MOSI: length 92.3
  Top Layer w0.254: 15.32,328.64 15.32,325.68 18.62,322.38 26.36,322.38 ; 15.82,396.34 15.82,393.38 19.12,390.08 26.87,390.08 ; 55.32,328.52 55.32,325.55 58.62,322.25 66.37,322.25 ; 55.83,396.22 55.83,393.26 59.13,389.95 66.87,389.95 ; 95.26,328.13 95.26,325.17 98.56,321.87 106.31,321.87 ; 95.76,395.84 95.76,392.88 99.07,389.57 106.81,389.57
